# EAGLE schematic front-panel (EAGLE 5.11)

## Sheet 1 of 7
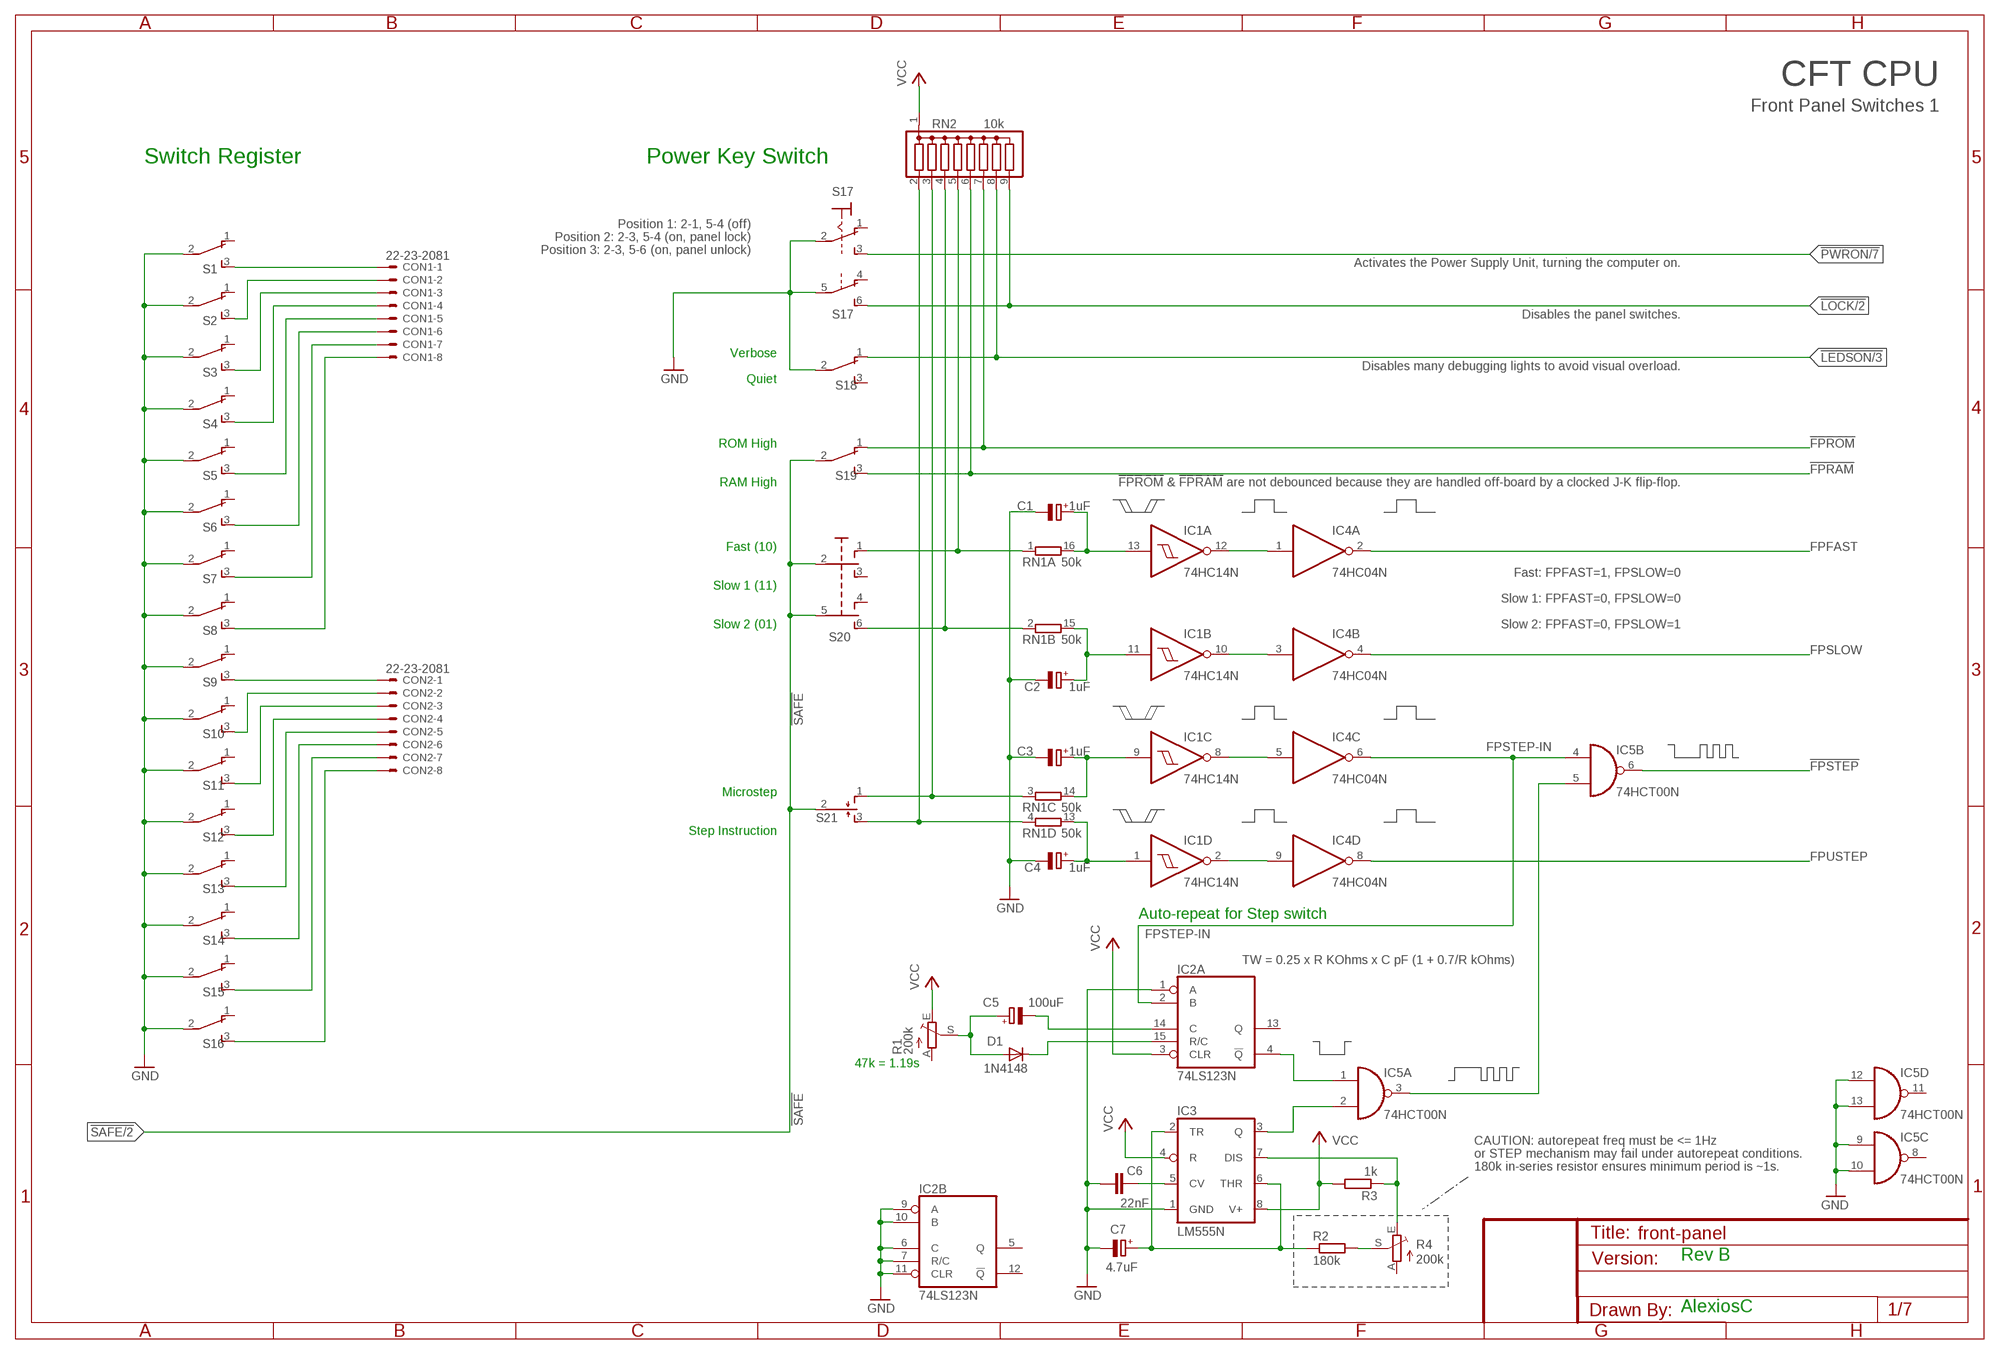
[diagram p0: schematic, sheet 1]

### Parts
C1  1uF  CPOL-EUE1.8-4  [E1,8-4]
C2  1uF  CPOL-EUE1.8-4  [E1,8-4]
C3  1uF  CPOL-EUE1.8-4  [E1,8-4]
C4  1uF  CPOL-EUE1.8-4  [E1,8-4]
C5  100uF  CPOL-EUE2,5-6E  [E2,5-6E]
C6  22nF  C-EU025-024X044  [C025-024X044]
C7  4.7uF  CPOL-EUE2,5-6E  [E2,5-6E]
CON1  22-23-2081  [22-23-2081]
CON2  22-23-2081  [22-23-2081]
D1  1N4148  1N4148DO35-7  [DO35-7]
IC1  74HC14N  [DIL14]
IC2  74LS123N  [DIL16]
IC3  LM555N  [DIL08]
IC4  74HC04N  [DIL14]
IC5  74HCT00N  [DIL14]
R1  200k  TRIM_EU-B90P  [SP19L]
R2  180k  R-EU_0207/10  [0207/10]
R3  1k  R-EU_0207/10  [0207/10]
R4  200k  TRIM_EU-B90P  [SP19L]
RN1  50k  8R-N  [DIL16]
RN2  10k  G08R  [SIL9]
S1  TL36PO  [TL3XPO]
S2  TL36PO  [TL3XPO]
S3  TL36PO  [TL3XPO]
S4  TL36PO  [TL3XPO]
S5  TL36PO  [TL3XPO]
S6  TL36PO  [TL3XPO]
S7  TL36PO  [TL3XPO]
S8  TL36PO  [TL3XPO]
S9  TL36PO  [TL3XPO]
S10  TL36PO  [TL3XPO]
S11  TL36PO  [TL3XPO]
S12  TL36PO  [TL3XPO]
S13  TL36PO  [TL3XPO]
S14  TL36PO  [TL3XPO]
S15  TL36PO  [TL3XPO]
S16  TL36PO  [TL3XPO]
S17  320-938  [320-938]
S18  TL36PO  [TL3XPO]
S19  TL36PO  [TL3XPO]
S20  TL49PO  [TL4XPO]
S21  TL37PO  [TL3XPO]

### Nets
!FPRAM: RN2.6 S19.3(S) ; also sheet 7
!FPROM: RN2.7 S19.1(O) ; also sheet 7
!FPSTEP: IC5.6(B:O) ; also sheet 7
!LEDSON: RN2.8 S18.1(O) ; also sheet 3,4,6
!LOCK: RN2.9 S17.6(B:S) ; also sheet 2
!PWRON: S17.3(1:S) ; also sheet 7
!SAFE: S20.2(P) S20.5(P1) S21.2(P) ; also sheet 2
FPFAST: IC4.2(A:O) ; also sheet 7
FPSLOW: IC4.4(B:O) ; also sheet 7
FPSTEP-IN: IC2.2(A:B) IC4.6(C:O) IC5.4(B:I0)
FPUSTEP: IC4.8(D:O) ; also sheet 7
GND: C1.- C2.- C3.- C4.- C6.2 C7.- IC2.1(A:A) IC2.6(B:C) IC2.7(B:R/C) IC2.9(B:A) IC2.10(B:B) IC2.11(B:CLR) IC3.1(GND) IC5.9(C:I0) IC5.10(C:I1) IC5.12(D:I0) IC5.13(D:I1) S1.2(P) S2.2(P) S3.2(P) S4.2(P) S5.2(P) S6.2(P) S7.2(P) S8.2(P) S9.2(P) S10.2(P) S11.2(P) S12.2(P) S13.2(P) S14.2(P) S15.2(P) S16.2(P) S17.2(1:P) S17.5(B:P) S18.2(P) ; also sheet 2,3,4,5,6,7
N$1: CON1.2 S2.3(S)
N$2: CON1.3 S3.3(S)
N$3: CON1.1 S1.3(S)
N$4: CON1.4 S4.3(S)
N$5: CON1.5 S5.3(S)
N$6: CON1.6 S6.3(S)
N$7: CON1.7 S7.3(S)
N$8: CON1.8 S8.3(S)
N$9: CON2.1 S9.3(S)
N$10: CON2.2 S10.3(S)
N$11: CON2.3 S11.3(S)
N$12: CON2.4 S12.3(S)
N$13: CON2.5 S13.3(S)
N$14: CON2.6 S14.3(S)
N$15: CON2.7 S15.3(S)
N$16: CON2.8 S16.3(S)
N$45: C3.+ IC1.9(C:I) RN1.14
N$48: C4.+ IC1.1(D:I) RN1.13
N$49: RN1.3 RN2.3 S21.1(O)
N$50: RN1.4 RN2.2 S21.3(S)
N$53: C1.+ IC1.13(A:I) RN1.16
N$54: RN1.1 RN2.5 S20.1(O)
N$55: RN1.2 RN2.4 S20.6(S1)
N$56: IC1.12(A:O) IC4.1(A:I)
N$57: C2.+ IC1.11(B:I) RN1.15
N$58: IC1.10(B:O) IC4.3(B:I)
N$78: IC1.2(D:O) IC4.9(D:I)
N$282: IC1.8(C:O) IC4.5(C:I)
N$293: R2.2 R4.S
N$323: C5.+ D1.A R1.S
N$324: IC3.3(Q) IC5.2(A:I1)
N$325: IC2.4(A:!Q) IC5.1(A:I0)
N$326: IC5.3(A:O) IC5.5(B:I1)
N$327: C6.1 IC3.5(CV)
N$328: IC3.7(DIS) R3.1 R4.E
N$329: D1.C IC2.15(A:R/C)
N$330: C5.- IC2.14(A:C)
N$331: C7.+ IC3.2(TR) IC3.6(THR) R2.1
VCC: IC2.3(A:CLR) IC3.4(R) IC3.8(V+) R1.E R3.2 RN2.1 ; also sheet 2,3,4,5,6,7
Unconnected: IC2.5(B:Q) IC2.12(B:!Q) IC2.13(A:Q) IC5.8(C:O) IC5.11(D:O) R1.A R4.A S1.1(O) S2.1(O) S3.1(O) S4.1(O) S5.1(O) S6.1(O) S7.1(O) S8.1(O) S9.1(O) S10.1(O) S11.1(O) S12.1(O) S13.1(O) S14.1(O) S15.1(O) S16.1(O) S17.1(1:O) S17.4(B:O) S18.3(S) S19.2(P) S20.3(S) S20.4(O1)

### Notes on the sheet
- CFT CPU
- Front Panel Switches 1
- Switch Register | Power Key Switch
- Position 1: 2-1, 5-4 (off)
- Position 2: 2-3, 5-4 (on, panel lock)
- Position 3: 2-3, 5-6 (on, panel unlock)
- Activates the Power Supply Unit, turning the computer on.
- Disables the panel switches.
- Verbose
- Disables many debugging lights to avoid visual overload.
- Quiet
- ROM High
- RAM High | !FPROM! & !FPRAM! are not debounced because they are handled off-board by a clocked J-K flip-flop.
- Fast (10)
- Fast: FPFAST=1, FPSLOW=0
- Slow 1 (11)
- Slow 1: FPFAST=0, FPSLOW=0
- Slow 2 (01) | Slow 2: FPFAST=0, FPSLOW=1
- Microstep
- Step Instruction
- Auto-repeat for Step switch
- TW = 0.25 x R KOhms x C pF (1 + 0.7/R kOhms)
- 47k = 1.19s
- CAUTION: autorepeat freq must be <= 1Hz
- or STEP mechanism may fail under autorepeat conditions.
- 180k in-series resistor ensures minimum period is ~1s.
- Rev B
- AlexiosC

## Sheet 2 of 7
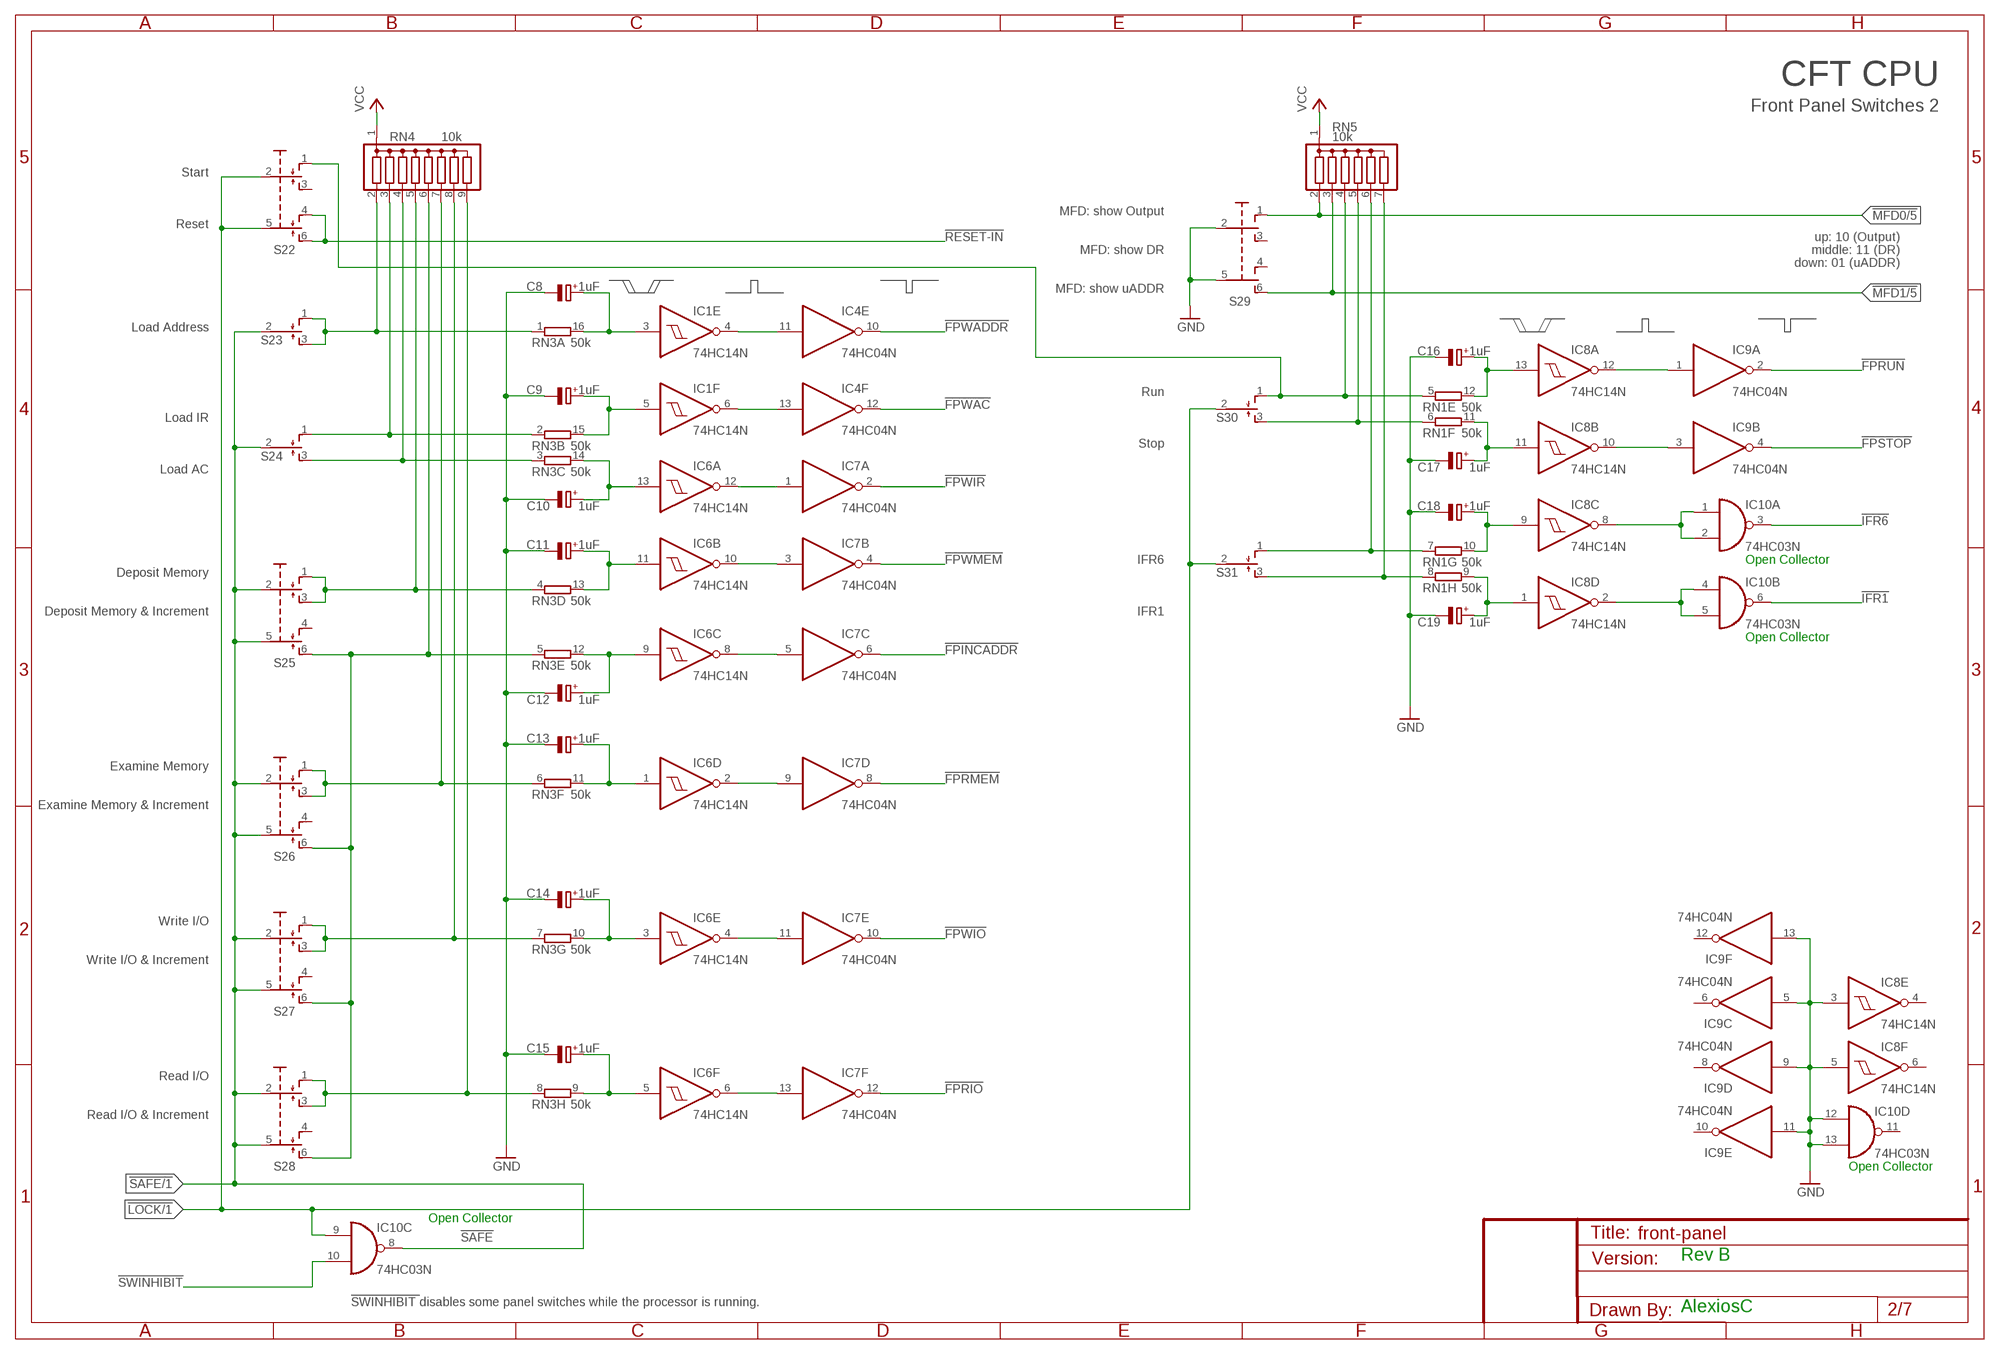
[diagram p1: schematic, sheet 2]

### Parts
C8  1uF  CPOL-EUE1.8-4  [E1,8-4]
C9  1uF  CPOL-EUE1.8-4  [E1,8-4]
C10  1uF  CPOL-EUE1.8-4  [E1,8-4]
C11  1uF  CPOL-EUE1.8-4  [E1,8-4]
C12  1uF  CPOL-EUE1.8-4  [E1,8-4]
C13  1uF  CPOL-EUE1.8-4  [E1,8-4]
C14  1uF  CPOL-EUE1.8-4  [E1,8-4]
C15  1uF  CPOL-EUE1.8-4  [E1,8-4]
C16  1uF  CPOL-EUE1.8-4  [E1,8-4]
C17  1uF  CPOL-EUE1.8-4  [E1,8-4]
C18  1uF  CPOL-EUE1.8-4  [E1,8-4]
C19  1uF  CPOL-EUE1.8-4  [E1,8-4]
IC6  74HC14N  [DIL14]
IC7  74HC04N  [DIL14]
IC8  74HC14N  [DIL14]
IC9  74HC04N  [DIL14]
IC10  74HC03N  [DIL14]
RN3  50k  8R-N  [DIL16]
RN4  10k  G08R  [SIL9]
RN5  10k  G06R  [SIL7]
S22  TL47PO  [TL4XPO]
S23  TL37PO  [TL3XPO]
S24  TL37PO  [TL3XPO]
S25  TL47PO  [TL4XPO]
S26  TL47PO  [TL4XPO]
S27  TL47PO  [TL4XPO]
S28  TL47PO  [TL4XPO]
S29  TL49PO  [TL4XPO]
S30  TL37PO  [TL3XPO]
S31  TL37PO  [TL3XPO]

### Nets
!FPINCADDR: IC7.6(C:O) ; also sheet 7
!FPRIO: IC7.12(F:O) ; also sheet 7
!FPRMEM: IC7.8(D:O) ; also sheet 7
!FPRUN: IC9.2(A:O) ; also sheet 7
!FPSTOP: IC9.4(B:O) ; also sheet 7
!FPWAC: IC4.12(F:O) ; also sheet 7
!FPWADDR: IC4.10(E:O) ; also sheet 7
!FPWIO: IC7.10(E:O) ; also sheet 7
!FPWIR: IC7.2(A:O) ; also sheet 7
!FPWMEM: IC7.4(B:O) ; also sheet 7
!IFR1: IC10.6(B:O) ; also sheet 6,7
!IFR6: IC10.3(A:O) ; also sheet 6,7
!LOCK: IC10.9(C:I0) S22.2(P) S22.5(P1) S30.2(P) S31.2(P) ; also sheet 1
!MFD0: RN5.2 S29.1(O) ; also sheet 5
!MFD1: RN5.3 S29.6(S1) ; also sheet 5
!RESET-IN: S22.4(O1) S22.6(S1) ; also sheet 7
!SAFE: IC10.8(C:O) S23.2(P) S24.2(P) S25.2(P) S25.5(P1) S26.2(P) S26.5(P1) S27.2(P) S27.5(P1) S28.2(P) S28.5(P1) ; also sheet 1
!SWINHIBIT: IC10.10(C:I1) ; also sheet 7
GND: C8.- C9.- C10.- C11.- C12.- C13.- C14.- C15.- C16.- C17.- C18.- C19.- IC8.3(E:I) IC8.5(F:I) IC9.5(C:I) IC9.9(D:I) IC9.11(E:I) IC9.13(F:I) IC10.12(D:I0) IC10.13(D:I1) S29.2(P) S29.5(P1) ; also sheet 1,3,4,5,6,7
N$17: C9.+ IC1.5(F:I) RN3.15
N$18: RN3.1 RN4.2 S23.1(O) S23.3(S)
N$19: C8.+ IC1.3(E:I) RN3.16
N$20: C10.+ IC6.13(A:I) RN3.14
N$21: IC1.4(E:O) IC4.11(E:I)
N$22: IC1.6(F:O) IC4.13(F:I)
N$23: IC6.12(A:O) IC7.1(A:I)
N$25: RN3.2 RN4.3 S24.1(O)
N$26: C14.+ IC6.3(E:I) RN3.10
N$27: IC6.10(B:O) IC7.3(B:I)
N$28: IC6.8(C:O) IC7.5(C:I)
N$29: C13.+ IC6.1(D:I) RN3.11
N$30: IC6.2(D:O) IC7.9(D:I)
N$31: IC6.4(E:O) IC7.11(E:I)
N$33: C15.+ IC6.5(F:I) RN3.9
N$35: IC6.6(F:O) IC7.13(F:I)
N$36: C11.+ IC6.11(B:I) RN3.13
N$37: RN3.3 RN4.4 S24.3(S)
N$38: RN3.4 RN4.5 S25.1(O) S25.3(S)
N$39: RN3.5 RN4.6 S25.6(S1) S26.6(S1) S27.6(S1) S28.6(S1)
N$40: RN3.6 RN4.7 S26.1(O) S26.3(S)
N$41: RN3.7 RN4.8 S27.1(O) S27.3(S)
N$42: RN3.8 RN4.9 S28.1(O) S28.3(S)
N$43: C16.+ IC8.13(A:I) RN1.12
N$44: C17.+ IC8.11(B:I) RN1.11
N$46: RN1.5 RN5.4 S22.1(O) S30.1(O)
N$47: RN1.6 RN5.5 S30.3(S)
N$51: C18.+ IC8.9(C:I) RN1.10
N$62: C19.+ IC8.1(D:I) RN1.9
N$77: RN1.7 RN5.6 S31.1(O)
N$79: RN1.8 RN5.7 S31.3(S)
N$80: IC8.8(C:O) IC10.1(A:I0) IC10.2(A:I1)
N$81: IC8.2(D:O) IC10.4(B:I0) IC10.5(B:I1)
N$295: IC8.12(A:O) IC9.1(A:I)
N$296: IC8.10(B:O) IC9.3(B:I)
N$297: C12.+ IC6.9(C:I) RN3.12
VCC: RN4.1 RN5.1 ; also sheet 1,3,4,5,6,7
Unconnected: IC8.4(E:O) IC8.6(F:O) IC9.6(C:O) IC9.8(D:O) IC9.10(E:O) IC9.12(F:O) IC10.11(D:O) S22.3(S) S25.4(O1) S26.4(O1) S27.4(O1) S28.4(O1) S29.3(S) S29.4(O1)

### Notes on the sheet
- CFT CPU
- Front Panel Switches 2
- Start
- MFD: show Output
- Reset
- up: 10 (Output)
- MFD: show DR | middle: 11 (DR)
- down: 01 (uADDR)
- MFD: show uADDR
- Load Address
- Run
- Load IR
- Stop
- Load AC
- IFR6 | Open Collector
- Deposit Memory
- Deposit Memory & Increment | IFR1
- Open Collector
- Examine Memory
- Examine Memory & Increment
- Write I/O
- Write I/O & Increment
- Read I/O
- Read I/O & Increment
- Open Collector
- Open Collector
- Rev B
- !SWINHIBIT !disables some panel switches while the processor is running.
- AlexiosC

## Sheet 3 of 7
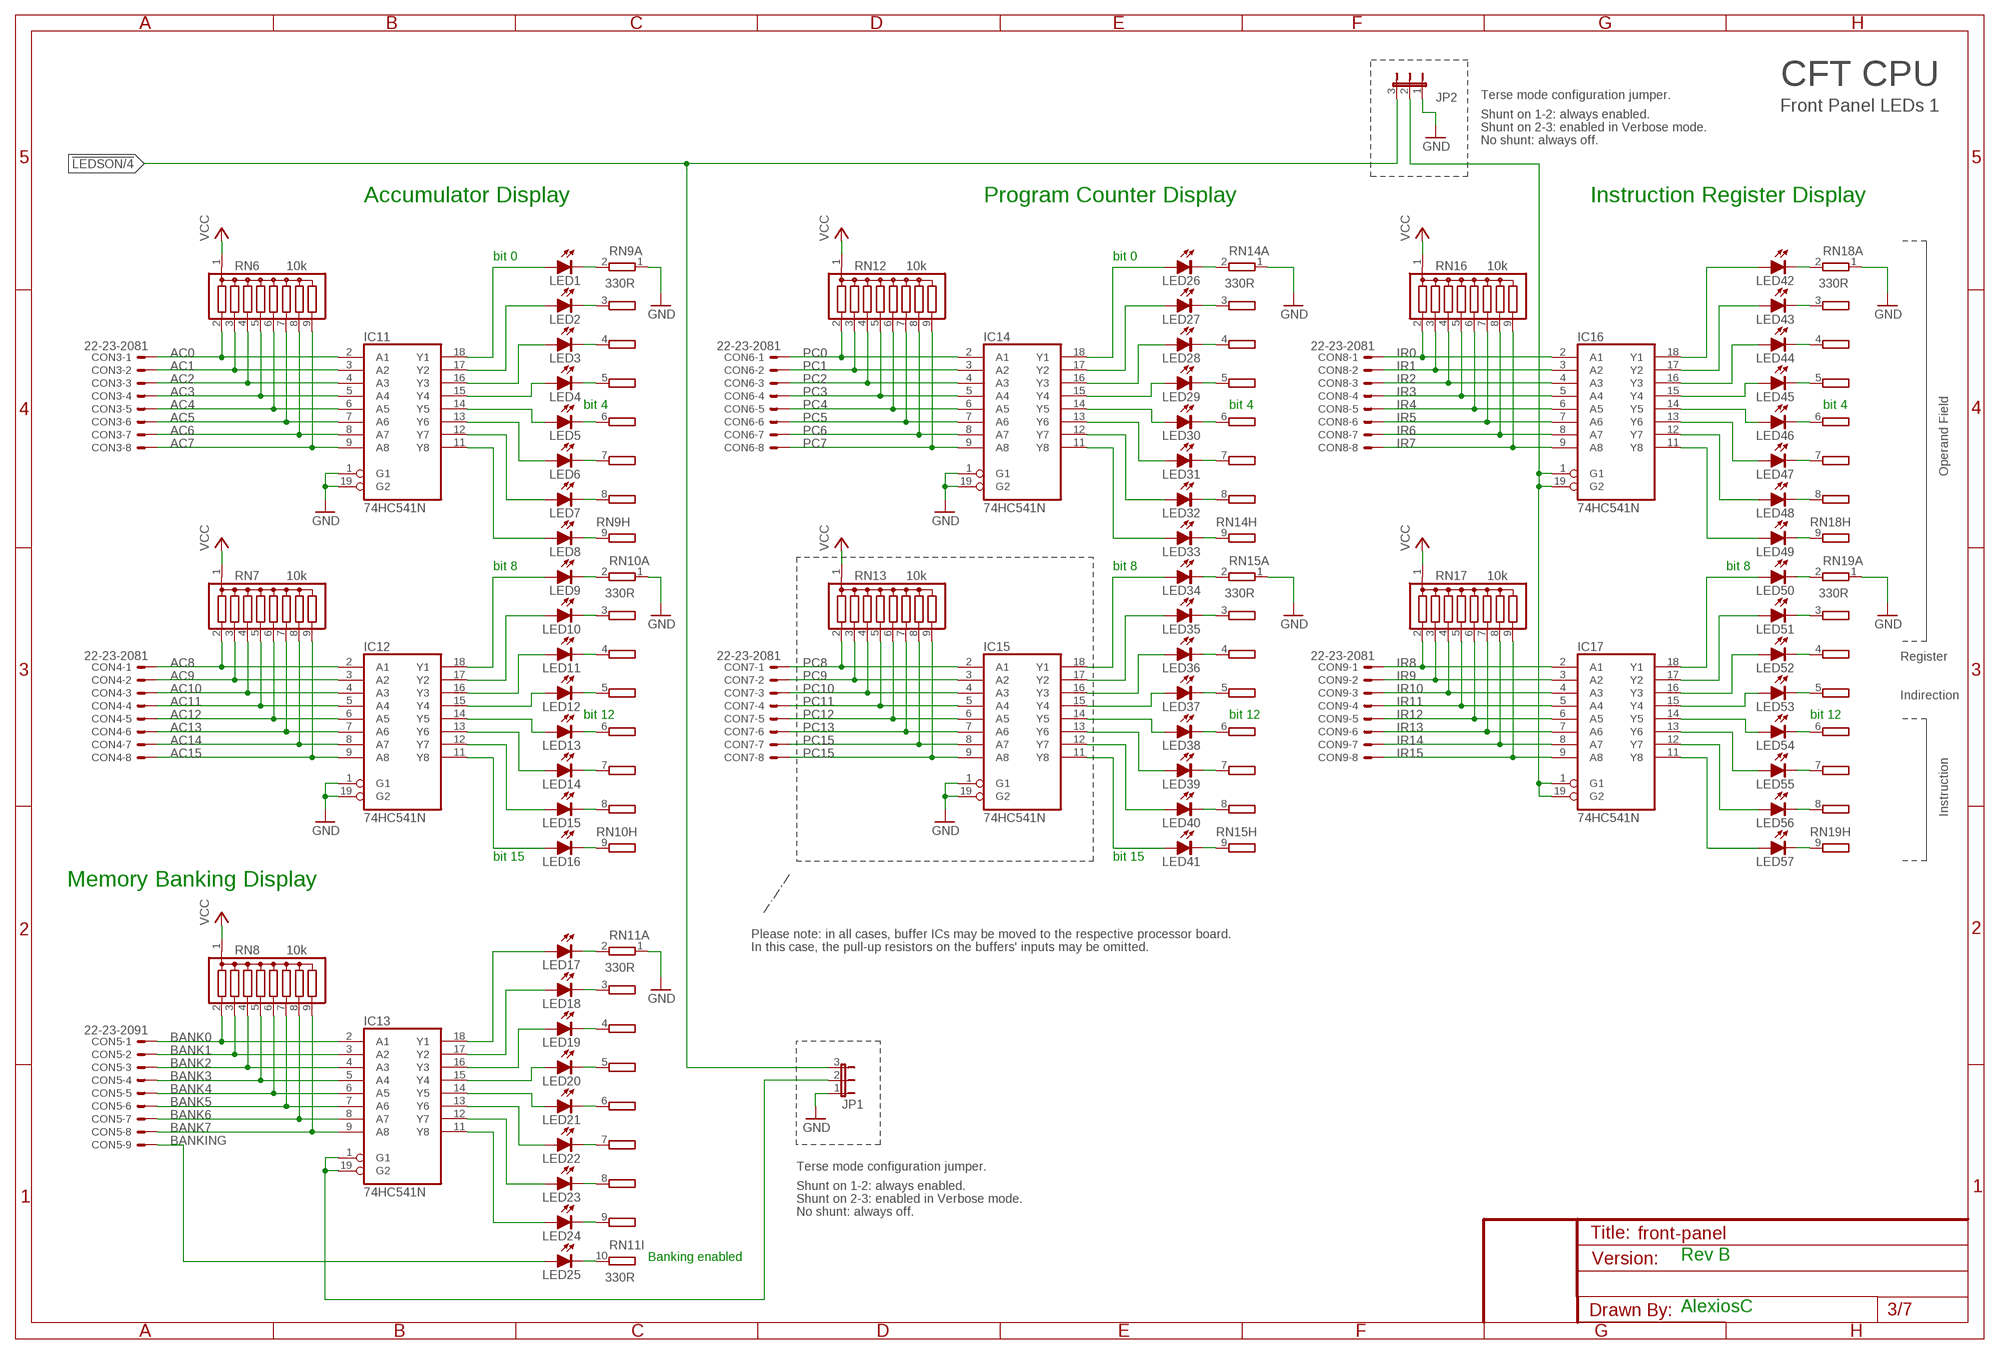
[diagram p2: schematic, sheet 3]

### Parts
CON3  22-23-2081  [22-23-2081]
CON4  22-23-2081  [22-23-2081]
CON5  22-23-2091  [22-23-2091]
CON6  22-23-2081  [22-23-2081]
CON7  22-23-2081  [22-23-2081]
CON8  22-23-2081  [22-23-2081]
CON9  22-23-2081  [22-23-2081]
IC11  74HC541N  [DIL20]
IC12  74HC541N  [DIL20]
IC13  74HC541N  [DIL20]
IC14  74HC541N  [DIL20]
IC15  74HC541N  [DIL20]
IC16  74HC541N  [DIL20]
IC17  74HC541N  [DIL20]
JP1  JP2E  [JP2]
JP2  JP2E  [JP2]
LED1  LED-5MM-RED  [LED5MM]
LED2  LED-5MM-RED  [LED5MM]
LED3  LED-5MM-RED  [LED5MM]
LED4  LED-5MM-RED  [LED5MM]
LED5  LED-5MM-RED  [LED5MM]
LED6  LED-5MM-RED  [LED5MM]
LED7  LED-5MM-RED  [LED5MM]
LED8  LED-5MM-RED  [LED5MM]
LED9  LED-5MM-RED  [LED5MM]
LED10  LED-5MM-RED  [LED5MM]
LED11  LED-5MM-RED  [LED5MM]
LED12  LED-5MM-RED  [LED5MM]
LED13  LED-5MM-RED  [LED5MM]
LED14  LED-5MM-RED  [LED5MM]
LED15  LED-5MM-RED  [LED5MM]
LED16  LED-5MM-RED  [LED5MM]
LED17  LED-5MM-AMBER  [LED5MM]
LED18  LED-5MM-AMBER  [LED5MM]
LED19  LED-5MM-AMBER  [LED5MM]
LED20  LED-5MM-AMBER  [LED5MM]
LED21  LED-5MM-AMBER  [LED5MM]
LED22  LED-5MM-AMBER  [LED5MM]
LED23  LED-5MM-AMBER  [LED5MM]
LED24  LED-5MM-AMBER  [LED5MM]
LED25  LED-5MM-GREEN  [LED5MM]
LED26  LED-5MM-RED  [LED5MM]
LED27  LED-5MM-RED  [LED5MM]
LED28  LED-5MM-RED  [LED5MM]
LED29  LED-5MM-RED  [LED5MM]
LED30  LED-5MM-RED  [LED5MM]
LED31  LED-5MM-RED  [LED5MM]
LED32  LED-5MM-RED  [LED5MM]
LED33  LED-5MM-RED  [LED5MM]
LED34  LED-5MM-RED  [LED5MM]
LED35  LED-5MM-RED  [LED5MM]
LED36  LED-5MM-RED  [LED5MM]
LED37  LED-5MM-RED  [LED5MM]
LED38  LED-5MM-RED  [LED5MM]
LED39  LED-5MM-RED  [LED5MM]
LED40  LED-5MM-RED  [LED5MM]
LED41  LED-5MM-RED  [LED5MM]
LED42  LED-5MM-RED  [LED5MM]
LED43  LED-5MM-RED  [LED5MM]
LED44  LED-5MM-RED  [LED5MM]
LED45  LED-5MM-RED  [LED5MM]
LED46  LED-5MM-RED  [LED5MM]
LED47  LED-5MM-RED  [LED5MM]
LED48  LED-5MM-RED  [LED5MM]
LED49  LED-5MM-RED  [LED5MM]
LED50  LED-5MM-RED  [LED5MM]
LED51  LED-5MM-RED  [LED5MM]
LED52  LED-5MM-AMBER  [LED5MM]
LED53  LED-5MM-RED  [LED5MM]
LED54  LED-5MM-AMBER  [LED5MM]
LED55  LED-5MM-AMBER  [LED5MM]
LED56  LED-5MM-AMBER  [LED5MM]
LED57  LED-5MM-AMBER  [LED5MM]
RN6  10k  G08R  [SIL9]
RN7  10k  G08R  [SIL9]
RN8  10k  G08R  [SIL9]
RN9  330R  GE08R  [SIL9]
RN10  330R  GE08R  [SIL9]
RN11  330R  GE09R  [SIL10]
RN12  10k  G08R  [SIL9]
RN13  10k  G08R  [SIL9]
RN14  330R  GE08R  [SIL9]
RN15  330R  GE08R  [SIL9]
RN16  10k  G08R  [SIL9]
RN17  10k  G08R  [SIL9]
RN18  330R  GE08R  [SIL9]
RN19  330R  GE08R  [SIL9]

### Nets
!LEDSON: JP1.3 JP2.3 ; also sheet 1,4,6
AC0: CON3.1 IC11.2(A1) RN6.2
AC1: CON3.2 IC11.3(A2) RN6.3
AC2: CON3.3 IC11.4(A3) RN6.4
AC3: CON3.4 IC11.5(A4) RN6.5
AC4: CON3.5 IC11.6(A5) RN6.6
AC5: CON3.6 IC11.7(A6) RN6.7
AC6: CON3.7 IC11.8(A7) RN6.8
AC7: CON3.8 IC11.9(A8) RN6.9
AC8: CON4.1 IC12.2(A1) RN7.2
AC9: CON4.2 IC12.3(A2) RN7.3
AC10: CON4.3 IC12.4(A3) RN7.4
AC11: CON4.4 IC12.5(A4) RN7.5
AC12: CON4.5 IC12.6(A5) RN7.6
AC13: CON4.6 IC12.7(A6) RN7.7
AC14: CON4.7 IC12.8(A7) RN7.8
AC15: CON4.8 IC12.9(A8) RN7.9
BANK0: CON5.1 IC13.2(A1) RN8.2
BANK1: CON5.2 IC13.3(A2) RN8.3
BANK2: CON5.3 IC13.4(A3) RN8.4
BANK3: CON5.4 IC13.5(A4) RN8.5
BANK4: CON5.5 IC13.6(A5) RN8.6
BANK5: CON5.6 IC13.7(A6) RN8.7
BANK6: CON5.7 IC13.8(A7) RN8.8
BANK7: CON5.8 IC13.9(A8) RN8.9
BANKING: CON5.9 LED25.A
GND: IC11.1(G1) IC11.19(G2) IC12.1(G1) IC12.19(G2) IC14.1(G1) IC14.19(G2) IC15.1(G1) IC15.19(G2) JP1.1 JP2.1 RN9.1 RN10.1 RN11.1 RN14.1 RN15.1 RN18.1 RN19.1 ; also sheet 1,2,4,5,6,7
IR0: CON8.1 IC16.2(A1) RN16.2
IR1: CON8.2 IC16.3(A2) RN16.3
IR2: CON8.3 IC16.4(A3) RN16.4
IR3: CON8.4 IC16.5(A4) RN16.5
IR4: CON8.5 IC16.6(A5) RN16.6
IR5: CON8.6 IC16.7(A6) RN16.7
IR6: CON8.7 IC16.8(A7) RN16.8
IR7: CON8.8 IC16.9(A8) RN16.9
IR8: CON9.1 IC17.2(A1) RN17.2
IR9: CON9.2 IC17.3(A2) RN17.3
IR10: CON9.3 IC17.4(A3) RN17.4
IR11: CON9.4 IC17.5(A4) RN17.5 ; also sheet 5
IR12: CON9.5 IC17.6(A5) RN17.6 ; also sheet 5
IR13: CON9.6 IC17.7(A6) RN17.7 ; also sheet 5
IR14: CON9.7 IC17.8(A7) RN17.8 ; also sheet 5
IR15: CON9.8 IC17.9(A8) RN17.9 ; also sheet 5
N$32: IC14.15(Y4) LED29.A
N$52: IC14.14(Y5) LED30.A
N$63: IC14.16(Y3) LED28.A
N$64: IC14.17(Y2) LED27.A
N$65: IC14.18(Y1) LED26.A
N$66: IC14.13(Y6) LED31.A
N$67: IC14.12(Y7) LED32.A
N$68: IC14.11(Y8) LED33.A
N$69: IC15.15(Y4) LED37.A
N$70: IC15.14(Y5) LED38.A
N$71: IC15.16(Y3) LED36.A
N$72: IC15.17(Y2) LED35.A
N$73: IC15.18(Y1) LED34.A
N$74: IC15.13(Y6) LED39.A
N$75: IC15.12(Y7) LED40.A
N$76: IC15.11(Y8) LED41.A
N$83: IC13.1(G1) IC13.19(G2) JP1.2
N$84: IC13.15(Y4) LED20.A
N$85: IC16.15(Y4) LED45.A
N$86: IC16.14(Y5) LED46.A
N$87: IC16.16(Y3) LED44.A
N$88: IC16.17(Y2) LED43.A
N$89: IC16.18(Y1) LED42.A
N$90: IC16.13(Y6) LED47.A
N$91: IC16.12(Y7) LED48.A
N$92: IC16.11(Y8) LED49.A
N$93: IC17.15(Y4) LED53.A
N$94: IC17.14(Y5) LED54.A
N$95: IC17.16(Y3) LED52.A
N$96: IC17.17(Y2) LED51.A
N$97: IC17.18(Y1) LED50.A
N$98: IC17.13(Y6) LED55.A
N$99: IC17.12(Y7) LED56.A
N$100: IC17.11(Y8) LED57.A
N$101: IC13.14(Y5) LED21.A
N$103: IC13.13(Y6) LED22.A
N$104: IC13.12(Y7) LED23.A
N$105: IC13.11(Y8) LED24.A
N$106: IC13.16(Y3) LED19.A
N$107: IC13.17(Y2) LED18.A
N$108: IC13.18(Y1) LED17.A
N$109: LED17.K(C) RN11.2
N$110: LED18.K(C) RN11.3
N$111: LED19.K(C) RN11.4
N$112: IC11.15(Y4) LED4.A
N$113: IC11.14(Y5) LED5.A
N$114: LED20.K(C) RN11.5
N$115: LED21.K(C) RN11.6
N$116: LED22.K(C) RN11.7
N$117: LED23.K(C) RN11.8
N$118: LED24.K(C) RN11.9
N$119: LED1.K(C) RN9.2
N$120: LED2.K(C) RN9.3
N$121: LED3.K(C) RN9.4
N$122: LED4.K(C) RN9.5
N$123: LED5.K(C) RN9.6
N$124: LED6.K(C) RN9.7
N$125: LED7.K(C) RN9.8
N$126: LED8.K(C) RN9.9
N$127: LED9.K(C) RN10.2
N$128: LED10.K(C) RN10.3
N$129: LED11.K(C) RN10.4
N$130: LED12.K(C) RN10.5
N$131: LED13.K(C) RN10.6
N$132: LED14.K(C) RN10.7
N$133: LED15.K(C) RN10.8
N$134: LED16.K(C) RN10.9
N$135: LED26.K(C) RN14.2
N$136: LED27.K(C) RN14.3
N$137: LED28.K(C) RN14.4
N$138: LED29.K(C) RN14.5
N$139: LED30.K(C) RN14.6
N$140: LED31.K(C) RN14.7
N$141: LED32.K(C) RN14.8
N$142: LED33.K(C) RN14.9
N$143: LED34.K(C) RN15.2
N$144: LED35.K(C) RN15.3
N$145: LED36.K(C) RN15.4
N$146: LED37.K(C) RN15.5
N$147: LED38.K(C) RN15.6
N$148: LED39.K(C) RN15.7
N$149: LED40.K(C) RN15.8
N$150: LED41.K(C) RN15.9
N$151: IC11.16(Y3) LED3.A
N$152: IC11.17(Y2) LED2.A
N$153: IC11.18(Y1) LED1.A
N$154: IC11.13(Y6) LED6.A
N$155: IC11.12(Y7) LED7.A
N$156: IC11.11(Y8) LED8.A
N$157: IC12.15(Y4) LED12.A
N$158: IC12.14(Y5) LED13.A
N$159: IC12.16(Y3) LED11.A
N$160: IC12.17(Y2) LED10.A
N$161: IC12.18(Y1) LED9.A
N$162: IC12.13(Y6) LED14.A
N$163: IC12.12(Y7) LED15.A
N$164: IC12.11(Y8) LED16.A
N$165: LED42.K(C) RN18.2
N$166: LED43.K(C) RN18.3
N$167: LED44.K(C) RN18.4
N$168: LED45.K(C) RN18.5
N$169: LED46.K(C) RN18.6
N$170: LED47.K(C) RN18.7
N$171: LED48.K(C) RN18.8
N$172: LED49.K(C) RN18.9
N$173: LED50.K(C) RN19.2
N$174: LED51.K(C) RN19.3
N$175: LED52.K(C) RN19.4
N$176: LED53.K(C) RN19.5
N$177: LED54.K(C) RN19.6
N$178: LED55.K(C) RN19.7
N$179: LED56.K(C) RN19.8
N$180: LED57.K(C) RN19.9
N$266: LED25.K(C) RN11.10
N$283: IC16.1(G1) IC16.19(G2) IC17.1(G1) IC17.19(G2) JP2.2
PC0: CON6.1 IC14.2(A1) RN12.2
PC1: CON6.2 IC14.3(A2) RN12.3
PC2: CON6.3 IC14.4(A3) RN12.4
PC3: CON6.4 IC14.5(A4) RN12.5
PC4: CON6.5 IC14.6(A5) RN12.6
PC5: CON6.6 IC14.7(A6) RN12.7
PC6: CON6.7 IC14.8(A7) RN12.8
PC7: CON6.8 IC14.9(A8) RN12.9
PC8: CON7.1 IC15.2(A1) RN13.2
PC9: CON7.2 IC15.3(A2) RN13.3
PC10: CON7.3 IC15.4(A3) RN13.4
PC11: CON7.4 IC15.5(A4) RN13.5
PC12: CON7.5 IC15.6(A5) RN13.6
PC13: CON7.6 IC15.7(A6) RN13.7
PC15: CON7.7 CON7.8 IC15.8(A7) IC15.9(A8) RN13.8 RN13.9
VCC: RN6.1 RN7.1 RN8.1 RN12.1 RN13.1 RN16.1 RN17.1 ; also sheet 1,2,4,5,6,7

### Notes on the sheet
- CFT CPU
- Terse mode configuration jumper.
- Front Panel LEDs 1
- Shunt on 1-2: always enabled.
- Shunt on 2-3: enabled in Verbose mode.
- No shunt: always off.
- Accumulator Display | Program Counter Display | Instruction Register Display
- bit 0 | bit 0
- Operand Field
- bit 4 | bit 4 | bit 4
- bit 8 | bit 8 | bit 8
- Register
- Indirection
- bit 12 | bit 12 | bit 12
- Instruction
- bit 15 | bit 15
- Memory Banking Display
- Please note: in all cases, buffer ICs may be moved to the respective processor board.
- In this case, the pull-up resistors on the buffers' inputs may be omitted.
- Terse mode configuration jumper.
- Shunt on 1-2: always enabled.
- Shunt on 2-3: enabled in Verbose mode.
- No shunt: always off.
- Banking enabled | Rev B
- AlexiosC

## Sheet 4 of 7
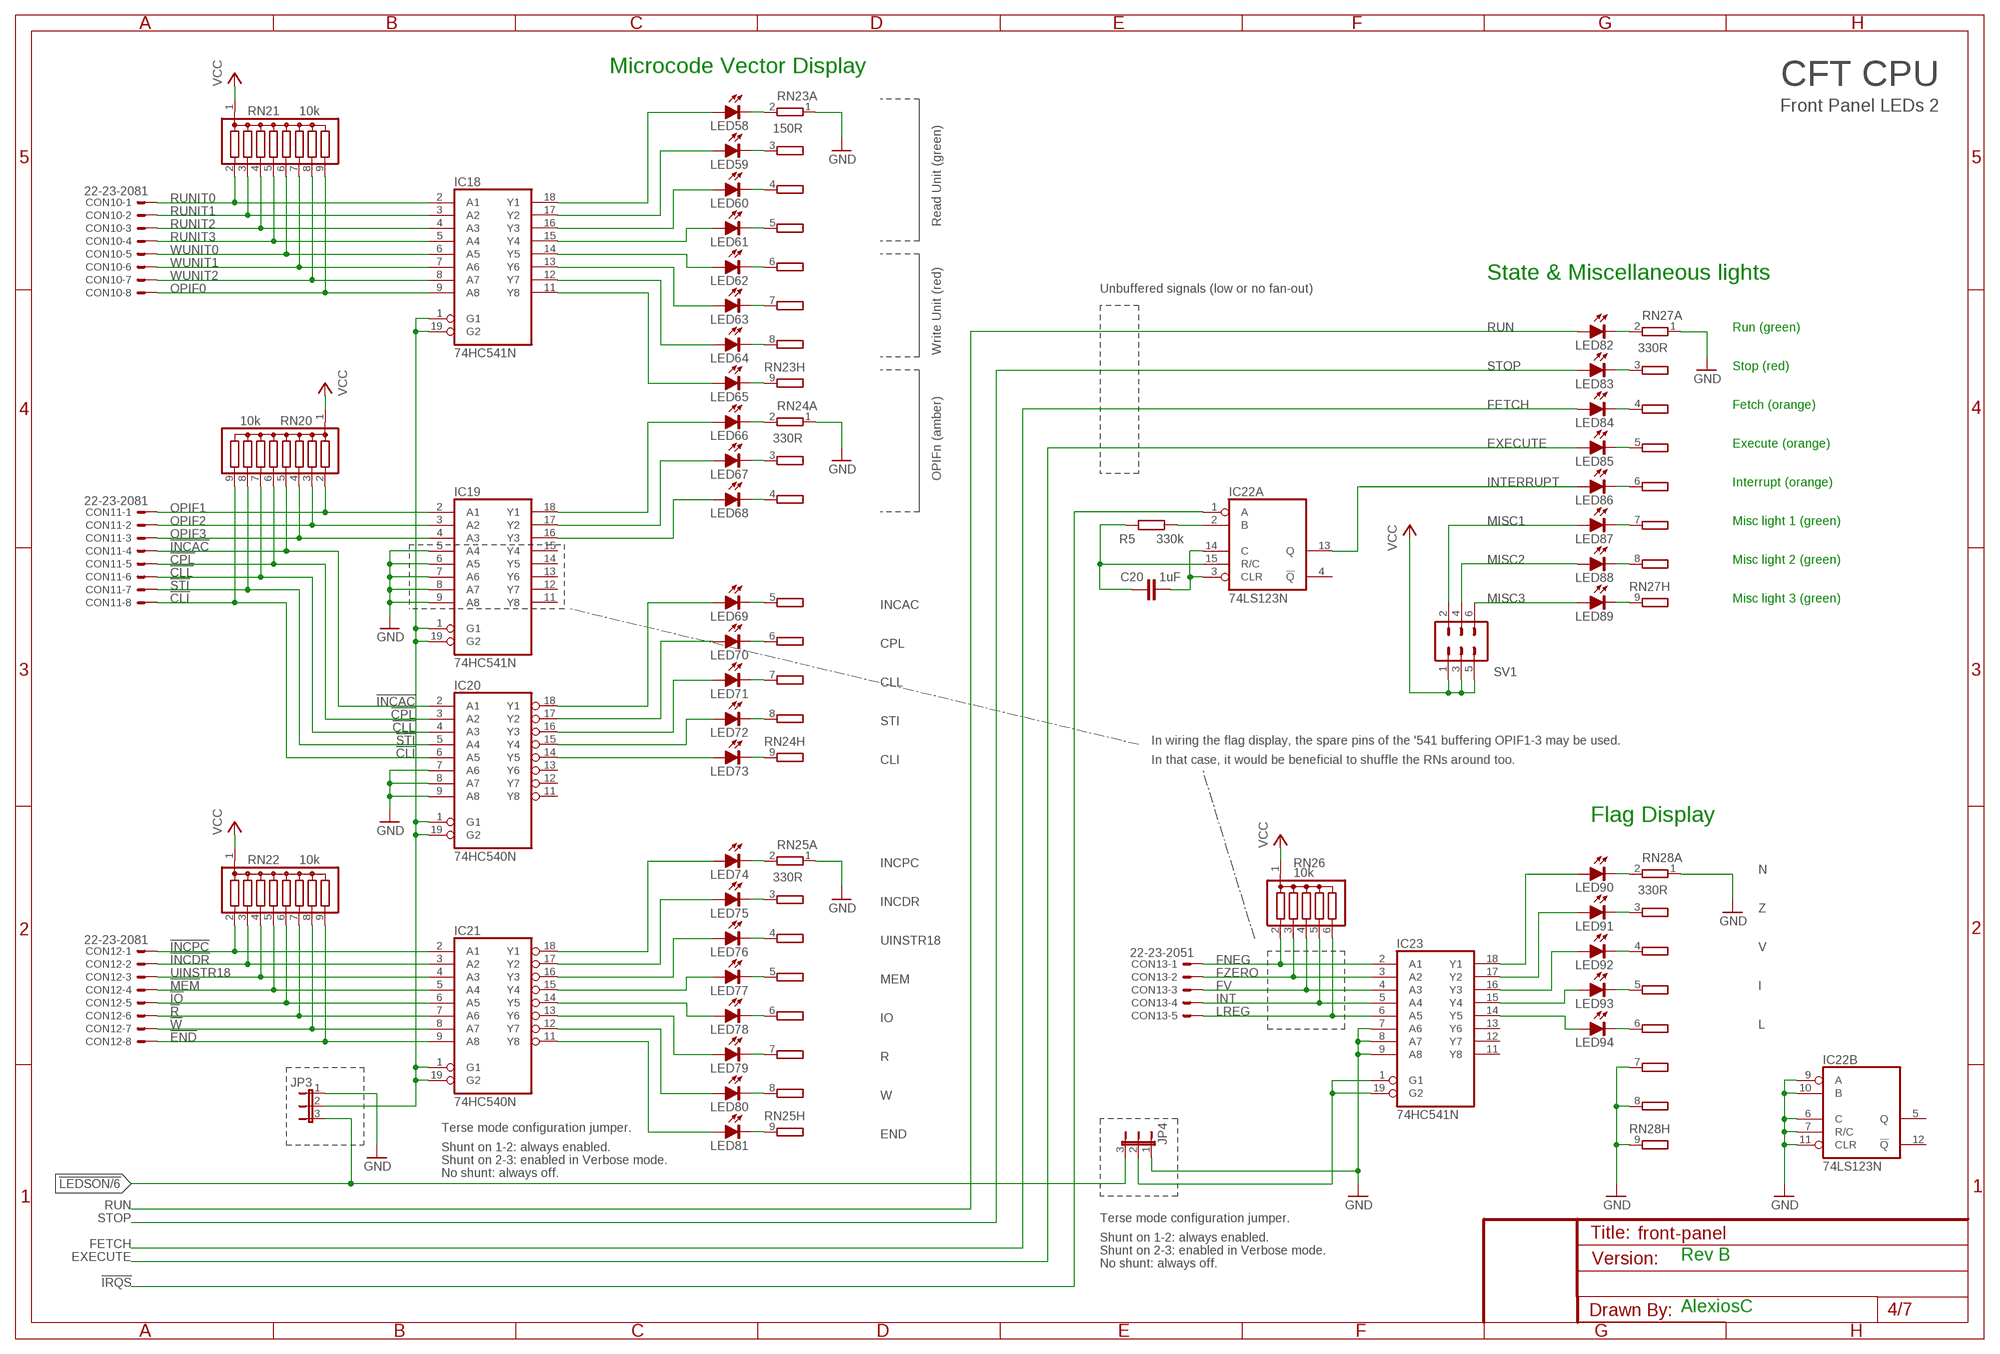
[diagram p3: schematic, sheet 4]

### Parts
C20  1uF  C-EU025-024X044  [C025-024X044]
CON10  22-23-2081  [22-23-2081]
CON11  22-23-2081  [22-23-2081]
CON12  22-23-2081  [22-23-2081]
CON13  22-23-2051  [22-23-2051]
IC18  74HC541N  [DIL20]
IC19  74HC541N  [DIL20]
IC20  74HC540N  [DIL20]
IC21  74HC540N  [DIL20]
IC22  74LS123N  [DIL16]
IC23  74HC541N  [DIL20]
JP3  JP2E  [JP2]
JP4  JP2E  [JP2]
LED58  LED-5MM-GREEN  [LED5MM]
LED59  LED-5MM-GREEN  [LED5MM]
LED60  LED-5MM-GREEN  [LED5MM]
LED61  LED-5MM-GREEN  [LED5MM]
LED62  LED-5MM-RED  [LED5MM]
LED63  LED-5MM-RED  [LED5MM]
LED64  LED-5MM-RED  [LED5MM]
LED65  LED-5MM-AMBER  [LED5MM]
LED66  LED-5MM-AMBER  [LED5MM]
LED67  LED-5MM-AMBER  [LED5MM]
LED68  LED-5MM-AMBER  [LED5MM]
LED69  LED-5MM-RED  [LED5MM]
LED70  LED-5MM-AMBER  [LED5MM]
LED71  LED-5MM-AMBER  [LED5MM]
LED72  LED-5MM-AMBER  [LED5MM]
LED73  LED-5MM-AMBER  [LED5MM]
LED74  LED-5MM-RED  [LED5MM]
LED75  LED-5MM-RED  [LED5MM]
LED76  LED-5MM-RED  [LED5MM]
LED77  LED-5MM-AMBER  [LED5MM]
LED78  LED-5MM-AMBER  [LED5MM]
LED79  LED-5MM-GREEN  [LED5MM]
LED80  LED-5MM-RED  [LED5MM]
LED81  LED-5MM-AMBER  [LED5MM]
LED82  LED-5MM-GREEN  [LED5MM]
LED83  LED-5MM-RED  [LED5MM]
LED84  LED-5MM-AMBER  [LED5MM]
LED85  LED-5MM-AMBER  [LED5MM]
LED86  LED-5MM-AMBER  [LED5MM]
LED87  LED-5MM-GREEN  [LED5MM]
LED88  LED-5MM-GREEN  [LED5MM]
LED89  LED-5MM-GREEN  [LED5MM]
LED90  LED-5MM-GREEN  [LED5MM]
LED91  LED-5MM-GREEN  [LED5MM]
LED92  LED-5MM-GREEN  [LED5MM]
LED93  LED-5MM-GREEN  [LED5MM]
LED94  LED-5MM-GREEN  [LED5MM]
R5  330k  R-EU_0204/5  [0204/5]
RN20  10k  G08R  [SIL9]
RN21  10k  G08R  [SIL9]
RN22  10k  G08R  [SIL9]
RN23  150R  GE08R  [SIL9]
RN24  330R  GE08R  [SIL9]
RN25  330R  GE08R  [SIL9]
RN26  10k  G05R  [SIL6]
RN27  330R  GE08R  [SIL9]
RN28  330R  GE08R  [SIL9]
SV1  3-pin-header  MA03-2  [MA03-2]

### Nets
!CLI: CON11.8 IC20.6(A5) RN20.9
!CLL: CON11.6 IC20.4(A3) RN20.7
!CPL: CON11.5 IC20.3(A2) RN20.6
!END: CON12.8 IC21.9(A8) RN22.9
!INCAC: CON11.4 IC20.2(A1) RN20.5
!INCDR: CON12.2 IC21.3(A2) RN22.3
!INCPC: CON12.1 IC21.2(A1) RN22.2
!IO: CON12.5 IC21.6(A5) RN22.6
!IRQS: IC22.1(A:A) ; also sheet 5,7
!LEDSON: JP3.3 JP4.3 ; also sheet 1,3,6
!MEM: CON12.4 IC21.5(A4) RN22.5
!R: CON12.6 IC21.7(A6) RN22.7
!STI: CON11.7 IC20.5(A4) RN20.8
!W: CON12.7 IC21.8(A7) RN22.8
EXECUTE: LED85.A ; also sheet 5
FETCH: LED84.A ; also sheet 5,7
FNEG: CON13.1 IC23.2(A1) RN26.2
FV: CON13.3 IC23.4(A3) RN26.4 ; also sheet 5
FZERO: CON13.2 IC23.3(A2) RN26.3
GND: IC19.5(A4) IC19.6(A5) IC19.7(A6) IC19.8(A7) IC19.9(A8) IC20.7(A6) IC20.8(A7) IC20.9(A8) IC22.6(B:C) IC22.7(B:R/C) IC22.9(B:A) IC22.10(B:B) IC22.11(B:CLR) IC23.7(A6) IC23.8(A7) IC23.9(A8) JP3.1 JP4.1 RN23.1 RN24.1 RN25.1 RN27.1 RN28.1 RN28.7 RN28.8 RN28.9 ; also sheet 1,2,3,5,6,7
INT: CON13.4 IC23.5(A4) RN26.5
INTERRUPT: IC22.13(A:Q) LED86.A
LREG: CON13.5 IC23.6(A5) RN26.6
MISC1: LED87.A SV1.2
MISC2: LED88.A SV1.4
MISC3: LED89.A SV1.6
N$24: IC23.1(G1) IC23.19(G2) JP4.2
N$59: C20.2 IC22.3(A:CLR) IC22.14(A:C)
N$60: IC22.2(A:B) R5.1
N$61: IC23.15(Y4) LED93.A
N$82: IC18.1(G1) IC18.19(G2) IC19.1(G1) IC19.19(G2) IC20.1(G1) IC20.19(G2) IC21.1(G1) IC21.19(G2) JP3.2
N$181: LED58.K(C) RN23.2
N$182: LED59.K(C) RN23.3
N$183: LED60.K(C) RN23.4
N$184: LED61.K(C) RN23.5
N$185: LED62.K(C) RN23.6
N$186: LED63.K(C) RN23.7
N$187: LED64.K(C) RN23.8
N$188: LED65.K(C) RN23.9
N$189: LED66.K(C) RN24.2
N$190: LED67.K(C) RN24.3
N$191: LED68.K(C) RN24.4
N$192: LED69.K(C) RN24.5
N$193: LED70.K(C) RN24.6
N$194: LED71.K(C) RN24.7
N$195: LED72.K(C) RN24.8
N$196: LED73.K(C) RN24.9
N$197: LED74.K(C) RN25.2
N$198: LED75.K(C) RN25.3
N$199: LED76.K(C) RN25.4
N$200: LED77.K(C) RN25.5
N$201: LED78.K(C) RN25.6
N$202: LED79.K(C) RN25.7
N$203: LED80.K(C) RN25.8
N$204: LED81.K(C) RN25.9
N$205: IC21.15(Y4) LED77.A
N$206: IC21.14(Y5) LED78.A
N$207: IC21.16(Y3) LED76.A
N$208: IC21.17(Y2) LED75.A
N$209: IC21.18(Y1) LED74.A
N$210: IC21.13(Y6) LED79.A
N$211: IC21.12(Y7) LED80.A
N$212: IC21.11(Y8) LED81.A
N$213: IC18.15(Y4) LED61.A
N$214: IC18.14(Y5) LED62.A
N$215: IC18.16(Y3) LED60.A
N$216: IC18.17(Y2) LED59.A
N$217: IC18.18(Y1) LED58.A
N$218: IC18.13(Y6) LED63.A
N$219: IC18.12(Y7) LED64.A
N$220: IC18.11(Y8) LED65.A
N$221: IC20.18(Y1) LED69.A
N$222: IC20.17(Y2) LED70.A
N$223: IC19.16(Y3) LED68.A
N$224: IC19.17(Y2) LED67.A
N$225: IC19.18(Y1) LED66.A
N$226: IC20.16(Y3) LED71.A
N$227: IC20.15(Y4) LED72.A
N$228: IC20.14(Y5) LED73.A
N$229: IC23.14(Y5) LED94.A
N$233: IC23.16(Y3) LED92.A
N$234: IC23.17(Y2) LED91.A
N$235: IC23.18(Y1) LED90.A
N$236: LED90.K(C) RN28.2
N$237: LED91.K(C) RN28.3
N$238: LED92.K(C) RN28.4
N$239: LED93.K(C) RN28.5
N$240: LED94.K(C) RN28.6
N$264: LED82.K(C) RN27.2
N$265: LED83.K(C) RN27.3
N$267: LED84.K(C) RN27.4
N$276: LED85.K(C) RN27.5
N$277: LED86.K(C) RN27.6
N$278: LED87.K(C) RN27.7
N$279: LED88.K(C) RN27.8
N$280: LED89.K(C) RN27.9
N$286: C20.1 IC22.15(A:R/C) R5.2
OPIF0: CON10.8 IC18.9(A8) RN21.9
OPIF1: CON11.1 IC19.2(A1) RN20.2
OPIF2: CON11.2 IC19.3(A2) RN20.3
OPIF3: CON11.3 IC19.4(A3) RN20.4
RUN: LED82.A ; also sheet 7
RUNIT0: CON10.1 IC18.2(A1) RN21.2
RUNIT1: CON10.2 IC18.3(A2) RN21.3
RUNIT2: CON10.3 IC18.4(A3) RN21.4
RUNIT3: CON10.4 IC18.5(A4) RN21.5
STOP: LED83.A ; also sheet 7
UINSTR18: CON12.3 IC21.4(A3) RN22.4
VCC: RN20.1 RN21.1 RN22.1 RN26.1 SV1.1 SV1.3 SV1.5 ; also sheet 1,2,3,5,6,7
WUNIT0: CON10.5 IC18.6(A5) RN21.6
WUNIT1: CON10.6 IC18.7(A6) RN21.7
WUNIT2: CON10.7 IC18.8(A7) RN21.8
Unconnected: IC19.11(Y8) IC19.12(Y7) IC19.13(Y6) IC19.14(Y5) IC19.15(Y4) IC20.11(Y8) IC20.12(Y7) IC20.13(Y6) IC22.4(A:!Q) IC22.5(B:Q) IC22.12(B:!Q) IC23.11(Y8) IC23.12(Y7) IC23.13(Y6)

### Notes on the sheet
- Microcode Vector Display
- CFT CPU
- Front Panel LEDs 2
- Read Unit (green)
- Write Unit (red)
- State & Miscellaneous lights
- Unbuffered signals (low or no fan-out)
- Run (green)
- Stop (red)
- OPIFn (amber)
- Fetch (orange)
- Execute (orange)
- Interrupt (orange)
- Misc light 1 (green)
- Misc light 2 (green)
- Misc light 3 (green)
- INCAC
- CPL
- CLL
- STI
- In wiring the flag display, the spare pins of the '541 buffering OPIF1-3 may be used.
- CLI | In that case, it would be beneficial to shuffle the RNs around too.
- Flag Display
- INCPC
- N
- INCDR
- Z
- UINSTR18
- V
- MEM
- I
- IO
- L
- R
- W
- Terse mode configuration jumper.
- END
- Shunt on 1-2: always enabled.
- Shunt on 2-3: enabled in Verbose mode.
- No shunt: always off.
- Terse mode configuration jumper.
- Shunt on 1-2: always enabled.
- Shunt on 2-3: enabled in Verbose mode.
- Rev B
- No shunt: always off.
- AlexiosC

## Sheet 5 of 7
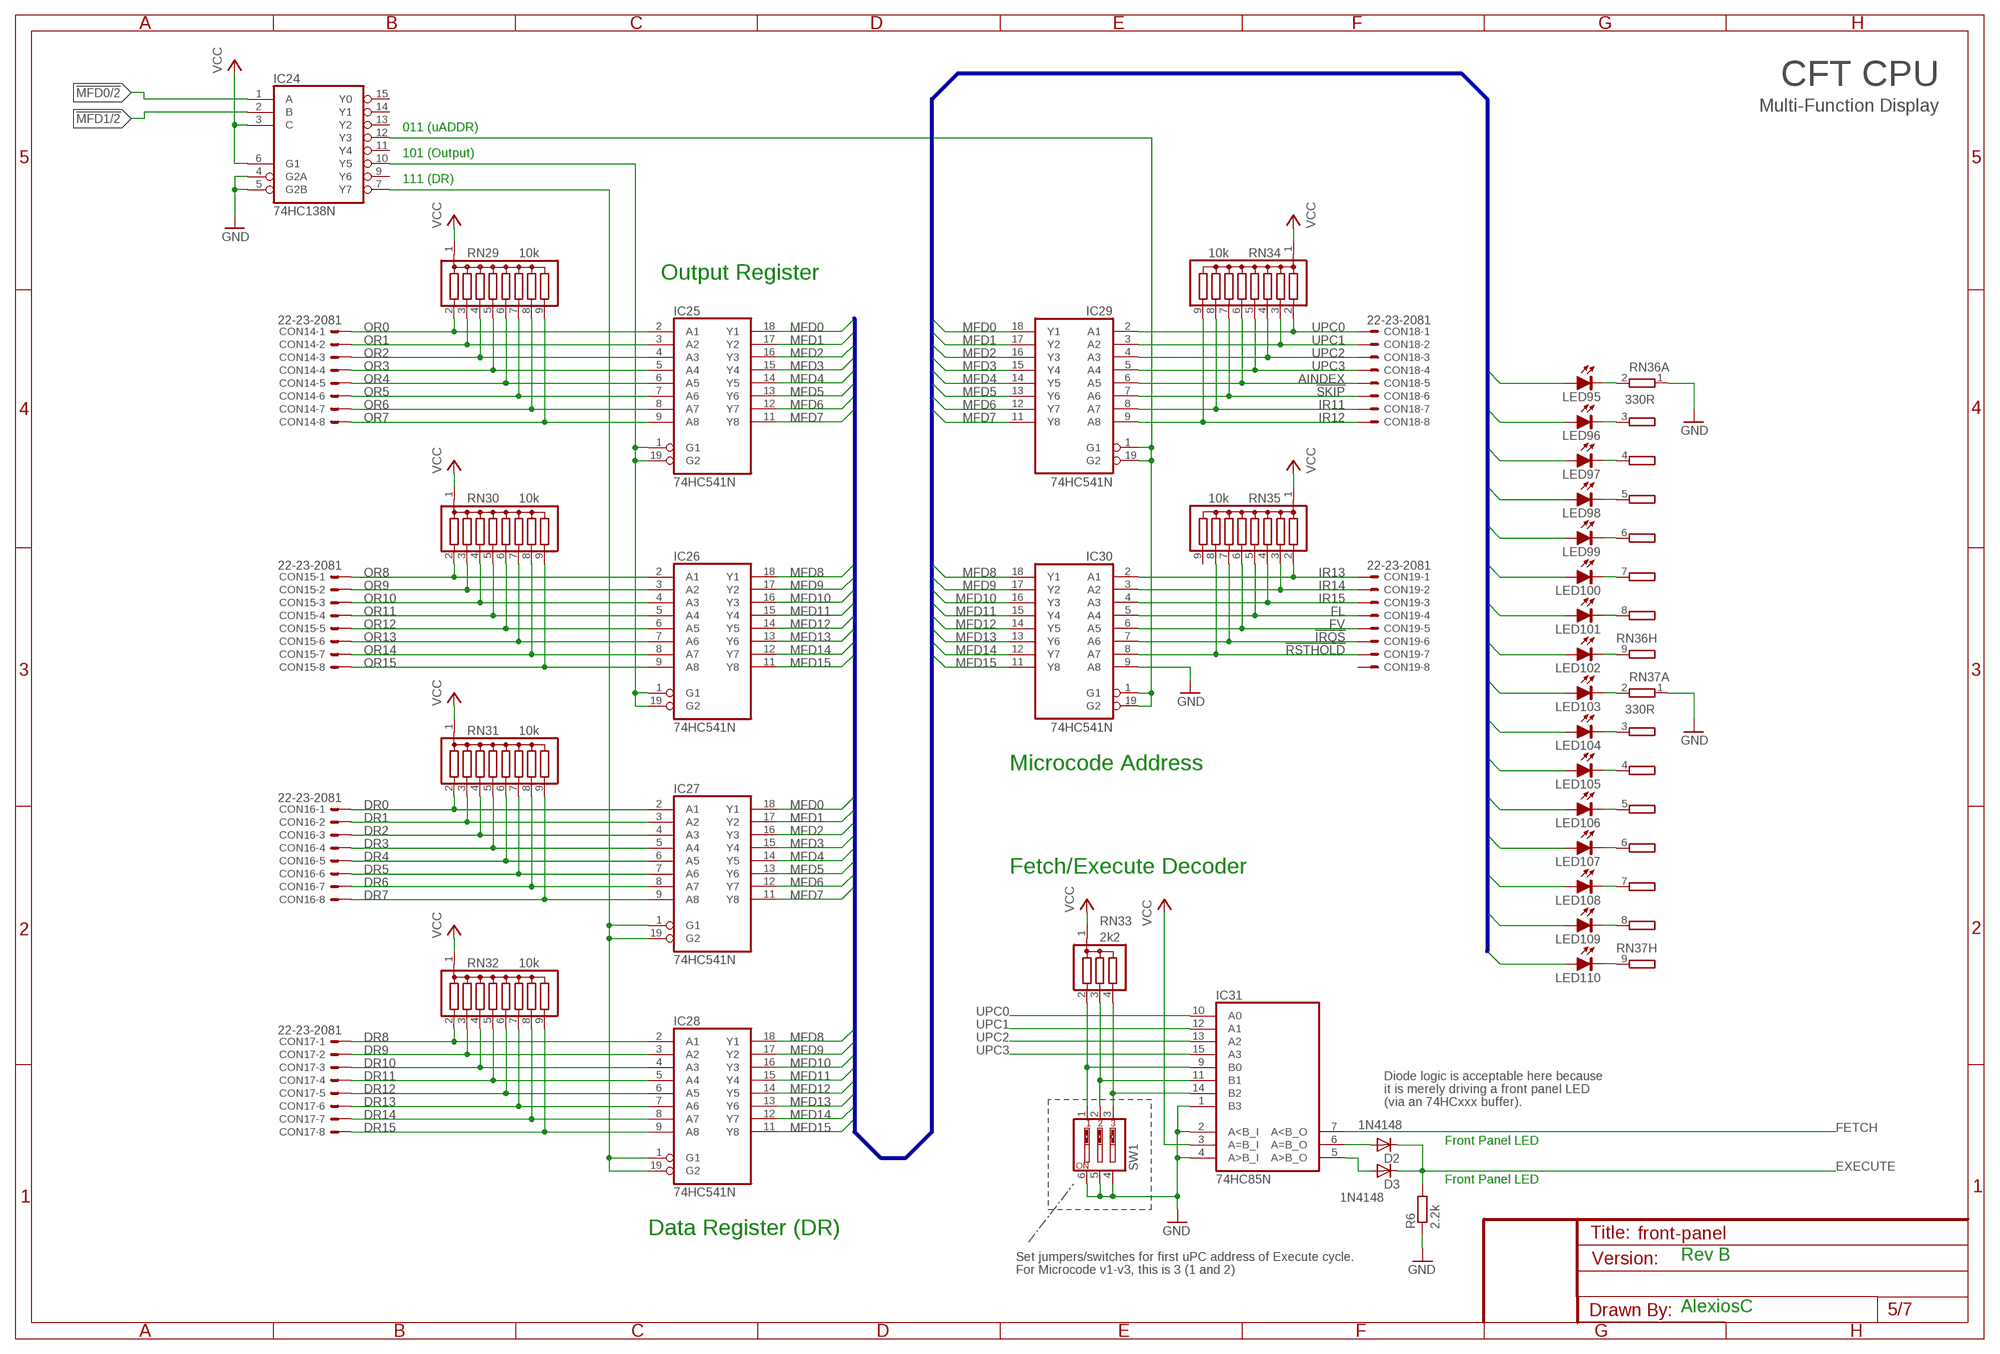
[diagram p4: schematic, sheet 5]

### Parts
CON14  22-23-2081  [22-23-2081]
CON15  22-23-2081  [22-23-2081]
CON16  22-23-2081  [22-23-2081]
CON17  22-23-2081  [22-23-2081]
CON18  22-23-2081  [22-23-2081]
CON19  22-23-2081  [22-23-2081]
D2  1N4148  1N4148DO35-7  [DO35-7]
D3  1N4148  1N4148DO35-7  [DO35-7]
IC24  74HC138N  [DIL16]
IC25  74HC541N  [DIL20]
IC26  74HC541N  [DIL20]
IC27  74HC541N  [DIL20]
IC28  74HC541N  [DIL20]
IC29  74HC541N  [DIL20]
IC30  74HC541N  [DIL20]
IC31  74HC85N  [DIL16]
LED95  LED-5MM-RED  [LED5MM]
LED96  LED-5MM-RED  [LED5MM]
LED97  LED-5MM-RED  [LED5MM]
LED98  LED-5MM-RED  [LED5MM]
LED99  LED-5MM-RED  [LED5MM]
LED100  LED-5MM-RED  [LED5MM]
LED101  LED-5MM-RED  [LED5MM]
LED102  LED-5MM-RED  [LED5MM]
LED103  LED-5MM-RED  [LED5MM]
LED104  LED-5MM-RED  [LED5MM]
LED105  LED-5MM-RED  [LED5MM]
LED106  LED-5MM-RED  [LED5MM]
LED107  LED-5MM-RED  [LED5MM]
LED108  LED-5MM-RED  [LED5MM]
LED109  LED-5MM-RED  [LED5MM]
LED110  LED-5MM-RED  [LED5MM]
R6  2.2k  R-EU_0204/7  [0204/7]
RN29  10k  G08R  [SIL9]
RN30  10k  G08R  [SIL9]
RN31  10k  G08R  [SIL9]
RN32  10k  G08R  [SIL9]
RN33  2k2  G03R  [SIL4]
RN34  10k  G08R  [SIL9]
RN35  10k  G08R  [SIL9]
RN36  330R  GE08R  [SIL9]
RN37  330R  GE08R  [SIL9]
SW1  SW_DIP-3  [EDG-03]

### Nets
!IRQS: CON19.6 IC30.7(A6) RN35.7 ; also sheet 4,7
!MFD0: IC24.1(A) ; also sheet 2
!MFD1: IC24.2(B) ; also sheet 2
!RSTHOLD: CON19.7 IC30.8(A7) RN35.8
!SKIP: CON18.6 IC29.7(A6) RN34.7
AINDEX: CON18.5 IC29.6(A5) RN34.6
DR0: CON16.1 IC27.2(A1) RN31.2
DR1: CON16.2 IC27.3(A2) RN31.3
DR2: CON16.3 IC27.4(A3) RN31.4
DR3: CON16.4 IC27.5(A4) RN31.5
DR4: CON16.5 IC27.6(A5) RN31.6
DR5: CON16.6 IC27.7(A6) RN31.7
DR6: CON16.7 IC27.8(A7) RN31.8
DR7: CON16.8 IC27.9(A8) RN31.9
DR8: CON17.1 IC28.2(A1) RN32.2
DR9: CON17.2 IC28.3(A2) RN32.3
DR10: CON17.3 IC28.4(A3) RN32.4
DR11: CON17.4 IC28.5(A4) RN32.5
DR12: CON17.5 IC28.6(A5) RN32.6
DR13: CON17.6 IC28.7(A6) RN32.7
DR14: CON17.7 IC28.8(A7) RN32.8
DR15: CON17.8 IC28.9(A8) RN32.9
EXECUTE: D2.C D3.C R6.2 ; also sheet 4
FETCH: IC31.7(A<B_O) ; also sheet 4,7
FL: CON19.4 IC30.5(A4) RN35.5
FV: CON19.5 IC30.6(A5) RN35.6 ; also sheet 4
GND: IC24.4(G2A) IC24.5(G2B) IC30.9(A8) IC31.1(B3) IC31.2(A<B_I) IC31.4(A>B_I) R6.1 RN36.1 RN37.1 SW1.4 SW1.5 SW1.6 ; also sheet 1,2,3,4,6,7
IR11: CON18.7 IC29.8(A7) RN34.8 ; also sheet 3
IR12: CON18.8 IC29.9(A8) RN34.9 ; also sheet 3
IR13: CON19.1 IC30.2(A1) RN35.2 ; also sheet 3
IR14: CON19.2 IC30.3(A2) RN35.3 ; also sheet 3
IR15: CON19.3 IC30.4(A3) RN35.4 ; also sheet 3
MFD0: IC25.18(Y1) IC27.18(Y1) IC29.18(Y1) LED95.A
MFD1: IC25.17(Y2) IC27.17(Y2) IC29.17(Y2) LED96.A
MFD2: IC25.16(Y3) IC27.16(Y3) IC29.16(Y3) LED97.A
MFD3: IC25.15(Y4) IC27.15(Y4) IC29.15(Y4) LED98.A
MFD4: IC25.14(Y5) IC27.14(Y5) IC29.14(Y5) LED99.A
MFD5: IC25.13(Y6) IC27.13(Y6) IC29.13(Y6) LED100.A
MFD6: IC25.12(Y7) IC27.12(Y7) IC29.12(Y7) LED101.A
MFD7: IC25.11(Y8) IC27.11(Y8) IC29.11(Y8) LED102.A
MFD8: IC26.18(Y1) IC28.18(Y1) IC30.18(Y1) LED103.A
MFD9: IC26.17(Y2) IC28.17(Y2) IC30.17(Y2) LED104.A
MFD10: IC26.16(Y3) IC28.16(Y3) IC30.16(Y3) LED105.A
MFD11: IC26.15(Y4) IC28.15(Y4) IC30.15(Y4) LED106.A
MFD12: IC26.14(Y5) IC28.14(Y5) IC30.14(Y5) LED107.A
MFD13: IC26.13(Y6) IC28.13(Y6) IC30.13(Y6) LED108.A
MFD14: IC26.12(Y7) IC28.12(Y7) IC30.12(Y7) LED109.A
MFD15: IC26.11(Y8) IC28.11(Y8) IC30.11(Y8) LED110.A
N$230: LED103.K(C) RN37.2
N$231: IC24.12(Y3) IC29.1(G1) IC29.19(G2) IC30.1(G1) IC30.19(G2)
N$232: LED104.K(C) RN37.3
N$241: IC24.7(Y7) IC27.1(G1) IC27.19(G2) IC28.1(G1) IC28.19(G2)
N$242: LED105.K(C) RN37.4
N$243: LED106.K(C) RN37.5
N$244: LED107.K(C) RN37.6
N$245: LED108.K(C) RN37.7
N$246: LED109.K(C) RN37.8
N$247: LED110.K(C) RN37.9
N$268: LED95.K(C) RN36.2
N$269: LED96.K(C) RN36.3
N$270: LED97.K(C) RN36.4
N$271: LED98.K(C) RN36.5
N$272: LED99.K(C) RN36.6
N$273: LED100.K(C) RN36.7
N$274: LED101.K(C) RN36.8
N$275: LED102.K(C) RN36.9
N$281: IC31.9(B0) RN33.2 SW1.1
N$284: IC31.11(B1) RN33.3 SW1.2
N$290: IC31.14(B2) RN33.4 SW1.3
N$291: D2.A IC31.6(A=B_O)
N$292: D3.A IC31.5(A>B_O)
N$313: IC24.10(Y5) IC25.1(G1) IC25.19(G2) IC26.1(G1) IC26.19(G2)
OR0: CON14.1 IC25.2(A1) RN29.2
OR1: CON14.2 IC25.3(A2) RN29.3
OR2: CON14.3 IC25.4(A3) RN29.4
OR3: CON14.4 IC25.5(A4) RN29.5
OR4: CON14.5 IC25.6(A5) RN29.6
OR5: CON14.6 IC25.7(A6) RN29.7
OR6: CON14.7 IC25.8(A7) RN29.8
OR7: CON14.8 IC25.9(A8) RN29.9
OR8: CON15.1 IC26.2(A1) RN30.2
OR9: CON15.2 IC26.3(A2) RN30.3
OR10: CON15.3 IC26.4(A3) RN30.4
OR11: CON15.4 IC26.5(A4) RN30.5
OR12: CON15.5 IC26.6(A5) RN30.6
OR13: CON15.6 IC26.7(A6) RN30.7
OR14: CON15.7 IC26.8(A7) RN30.8
OR15: CON15.8 IC26.9(A8) RN30.9
UPC0: CON18.1 IC29.2(A1) IC31.10(A0) RN34.2
UPC1: CON18.2 IC29.3(A2) IC31.12(A1) RN34.3
UPC2: CON18.3 IC29.4(A3) IC31.13(A2) RN34.4
UPC3: CON18.4 IC29.5(A4) IC31.15(A3) RN34.5
VCC: IC24.3(C) IC24.6(G1) IC31.3(A=B_I) RN29.1 RN30.1 RN31.1 RN32.1 RN33.1 RN34.1 RN35.1 ; also sheet 1,2,3,4,6,7
Unconnected: CON19.8 IC24.9(Y6) IC24.11(Y4) IC24.13(Y2) IC24.14(Y1) IC24.15(Y0) RN35.9

### Buses
MFD[0..15]

### Notes on the sheet
- CFT CPU
- Multi-Function Display
- 011 (uADDR)
- 101 (Output)
- 111 (DR)
- Output Register
- Microcode Address
- Fetch/Execute Decoder
- Diode logic is acceptable here because
- it is merely driving a front panel LED
- (via an 74HCxxx buffer).
- Front Panel LED
- Front Panel LED
- Data Register (DR)
- Set jumpers/switches for first uPC address of Execute cycle. | Rev B
- For Microcode v1-v3, this is 3 (1 and 2)
- AlexiosC

## Sheet 6 of 7
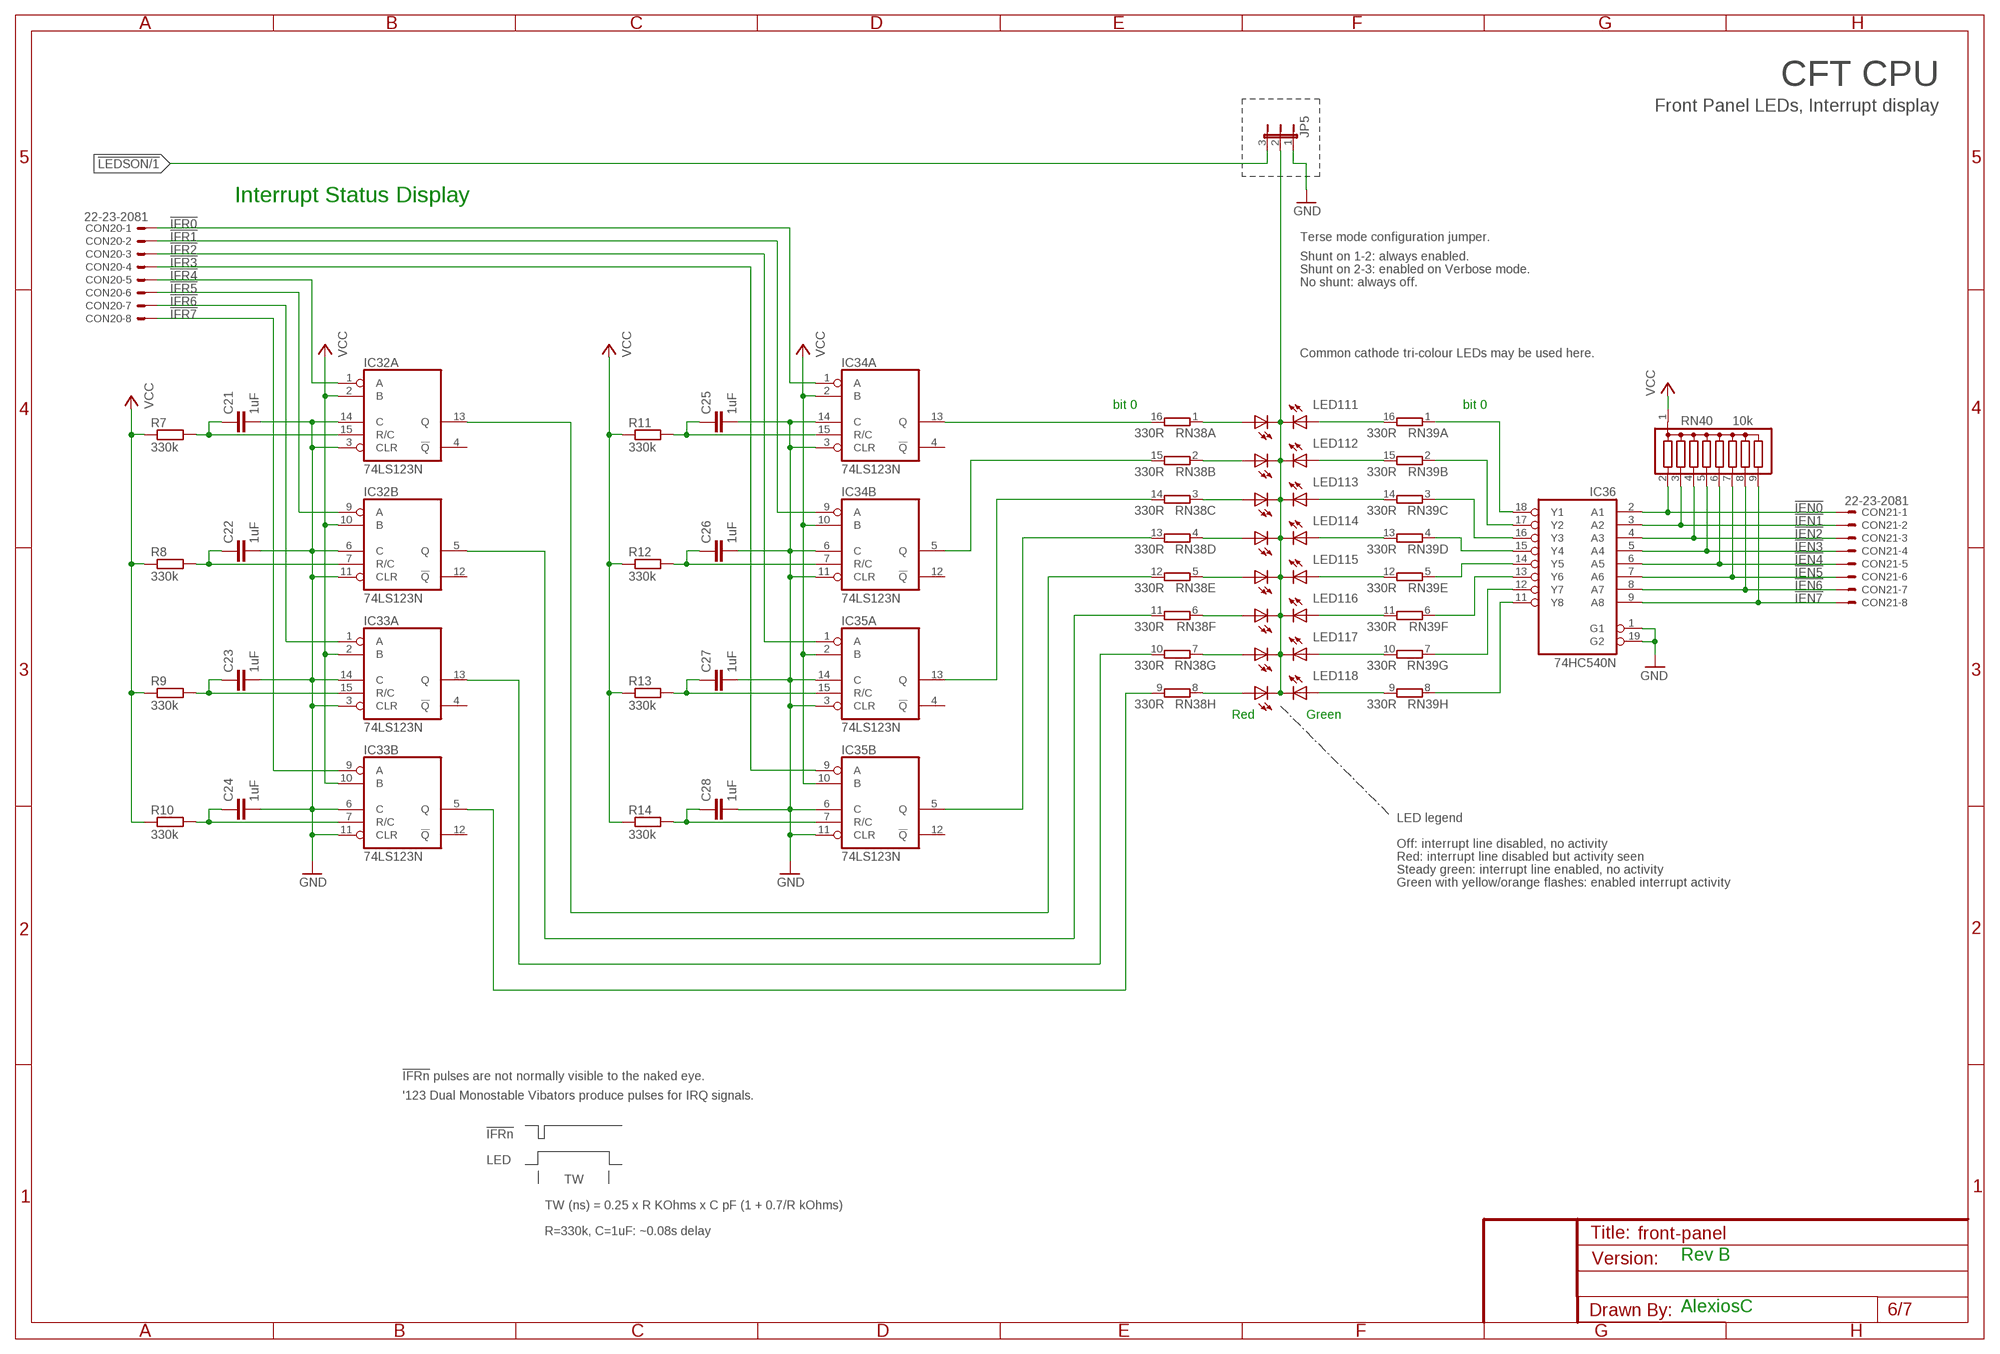
[diagram p5: schematic, sheet 6]

### Parts
C21  1uF  C-EU025-024X044  [C025-024X044]
C22  1uF  C-EU025-024X044  [C025-024X044]
C23  1uF  C-EU025-024X044  [C025-024X044]
C24  1uF  C-EU025-024X044  [C025-024X044]
C25  1uF  C-EU025-024X044  [C025-024X044]
C26  1uF  C-EU025-024X044  [C025-024X044]
C27  1uF  C-EU025-024X044  [C025-024X044]
C28  1uF  C-EU025-024X044  [C025-024X044]
CON20  22-23-2081  [22-23-2081]
CON21  22-23-2081  [22-23-2081]
IC32  74LS123N  [DIL16]
IC33  74LS123N  [DIL16]
IC34  74LS123N  [DIL16]
IC35  74LS123N  [DIL16]
IC36  74HC540N  [DIL20]
JP5  JP2E  [JP2]
LED111  DUOLED-C  [DUOLED-C-5MM]
LED112  DUOLED-C  [DUOLED-C-5MM]
LED113  DUOLED-C  [DUOLED-C-5MM]
LED114  DUOLED-C  [DUOLED-C-5MM]
LED115  DUOLED-C  [DUOLED-C-5MM]
LED116  DUOLED-C  [DUOLED-C-5MM]
LED117  DUOLED-C  [DUOLED-C-5MM]
LED118  DUOLED-C  [DUOLED-C-5MM]
R7  330k  R-EU_0204/5  [0204/5]
R8  330k  R-EU_0204/5  [0204/5]
R9  330k  R-EU_0204/5  [0204/5]
R10  330k  R-EU_0204/5  [0204/5]
R11  330k  R-EU_0204/5  [0204/5]
R12  330k  R-EU_0204/5  [0204/5]
R13  330k  R-EU_0204/5  [0204/5]
R14  330k  R-EU_0204/5  [0204/5]
RN38  330R  8R-N  [DIL16]
RN39  330R  8R-N  [DIL16]
RN40  10k  G08R  [SIL9]

### Nets
!IEN0: CON21.1 IC36.2(A1) RN40.2
!IEN1: CON21.2 IC36.3(A2) RN40.3
!IEN2: CON21.3 IC36.4(A3) RN40.4
!IEN3: CON21.4 IC36.5(A4) RN40.5
!IEN4: CON21.5 IC36.6(A5) RN40.6
!IEN5: CON21.6 IC36.7(A6) RN40.7
!IEN6: CON21.7 IC36.8(A7) RN40.8
!IEN7: CON21.8 IC36.9(A8) RN40.9
!IFR0: CON20.1 IC34.1(A:A)
!IFR1: CON20.2 IC34.9(B:A) ; also sheet 2,7
!IFR2: CON20.3 IC35.1(A:A)
!IFR3: CON20.4 IC35.9(B:A)
!IFR4: CON20.5 IC32.1(A:A)
!IFR5: CON20.6 IC32.9(B:A)
!IFR6: CON20.7 IC33.1(A:A) ; also sheet 2,7
!IFR7: CON20.8 IC33.9(B:A)
!LEDSON: JP5.3 ; also sheet 1,3,4
GND: C21.2 C22.2 C23.2 C24.2 C25.2 C26.2 C27.2 C28.2 IC32.3(A:CLR) IC32.6(B:C) IC32.11(B:CLR) IC32.14(A:C) IC33.3(A:CLR) IC33.6(B:C) IC33.11(B:CLR) IC33.14(A:C) IC34.3(A:CLR) IC34.6(B:C) IC34.11(B:CLR) IC34.14(A:C) IC35.3(A:CLR) IC35.6(B:C) IC35.11(B:CLR) IC35.14(A:C) IC36.1(G1) IC36.19(G2) JP5.1 ; also sheet 1,2,3,4,5,7
N$102: JP5.2 LED111.C LED112.C LED113.C LED114.C LED115.C LED116.C LED117.C LED118.C
N$248: LED118.AX(AG) RN39.9
N$249: LED117.AX(AG) RN39.10
N$250: LED116.AX(AG) RN39.11
N$251: LED115.AX(AG) RN39.12
N$252: LED114.AX(AG) RN39.13
N$253: LED113.AX(AG) RN39.14
N$254: LED112.AX(AG) RN39.15
N$255: LED111.AX(AG) RN39.16
N$256: LED118.AR RN38.8
N$257: LED117.AR RN38.7
N$258: LED116.AR RN38.6
N$259: LED115.AR RN38.5
N$260: LED114.AR RN38.4
N$261: LED113.AR RN38.3
N$262: LED112.AR RN38.2
N$263: LED111.AR RN38.1
N$285: IC32.13(A:Q) RN38.12
N$287: IC33.5(B:Q) RN38.9
N$288: IC33.13(A:Q) RN38.10
N$289: IC32.5(B:Q) RN38.11
N$303: C21.1 IC32.15(A:R/C) R7.2
N$304: C22.1 IC32.7(B:R/C) R8.2
N$305: C23.1 IC33.15(A:R/C) R9.2
N$306: C24.1 IC33.7(B:R/C) R10.2
N$307: C28.1 IC35.7(B:R/C) R14.2
N$308: C27.1 IC35.15(A:R/C) R13.2
N$309: C26.1 IC34.7(B:R/C) R12.2
N$310: C25.1 IC34.15(A:R/C) R11.2
N$347: IC36.15(Y4) RN39.4
N$348: IC36.14(Y5) RN39.5
N$349: IC36.16(Y3) RN39.3
N$350: IC36.17(Y2) RN39.2
N$351: IC36.18(Y1) RN39.1
N$352: IC36.13(Y6) RN39.6
N$353: IC36.12(Y7) RN39.7
N$354: IC36.11(Y8) RN39.8
N$355: IC35.5(B:Q) RN38.13
N$357: IC35.13(A:Q) RN38.14
N$358: IC34.5(B:Q) RN38.15
N$359: IC34.13(A:Q) RN38.16
VCC: IC32.2(A:B) IC32.10(B:B) IC33.2(A:B) IC33.10(B:B) IC34.2(A:B) IC34.10(B:B) IC35.2(A:B) IC35.10(B:B) R7.1 R8.1 R9.1 R10.1 R11.1 R12.1 R13.1 R14.1 RN40.1 ; also sheet 1,2,3,4,5,7
Unconnected: IC32.4(A:!Q) IC32.12(B:!Q) IC33.4(A:!Q) IC33.12(B:!Q) IC34.4(A:!Q) IC34.12(B:!Q) IC35.4(A:!Q) IC35.12(B:!Q)

### Notes on the sheet
- CFT CPU
- Front Panel LEDs, Interrupt display
- Interrupt Status Display
- Terse mode configuration jumper.
- Shunt on 1-2: always enabled.
- Shunt on 2-3: enabled on Verbose mode.
- No shunt: always off.
- Common cathode tri-colour LEDs may be used here.
- bit 0 | bit 0
- Red | Green
- LED legend
- Off: interrupt line disabled, no activity
- Red: interrupt line disabled but activity seen
- Steady green: interrupt line enabled, no activity
- Green with yellow/orange flashes: enabled interrupt activity
- !IFRn! pulses are not normally visible to the naked eye.
- '123 Dual Monostable Vibators produce pulses for IRQ signals.
- !IFRn!
- LED
- TW
- TW (ns) = 0.25 x R KOhms x C pF (1 + 0.7/R kOhms)
- R=330k, C=1uF: ~0.08s delay
- Rev B
- AlexiosC

## Sheet 7 of 7
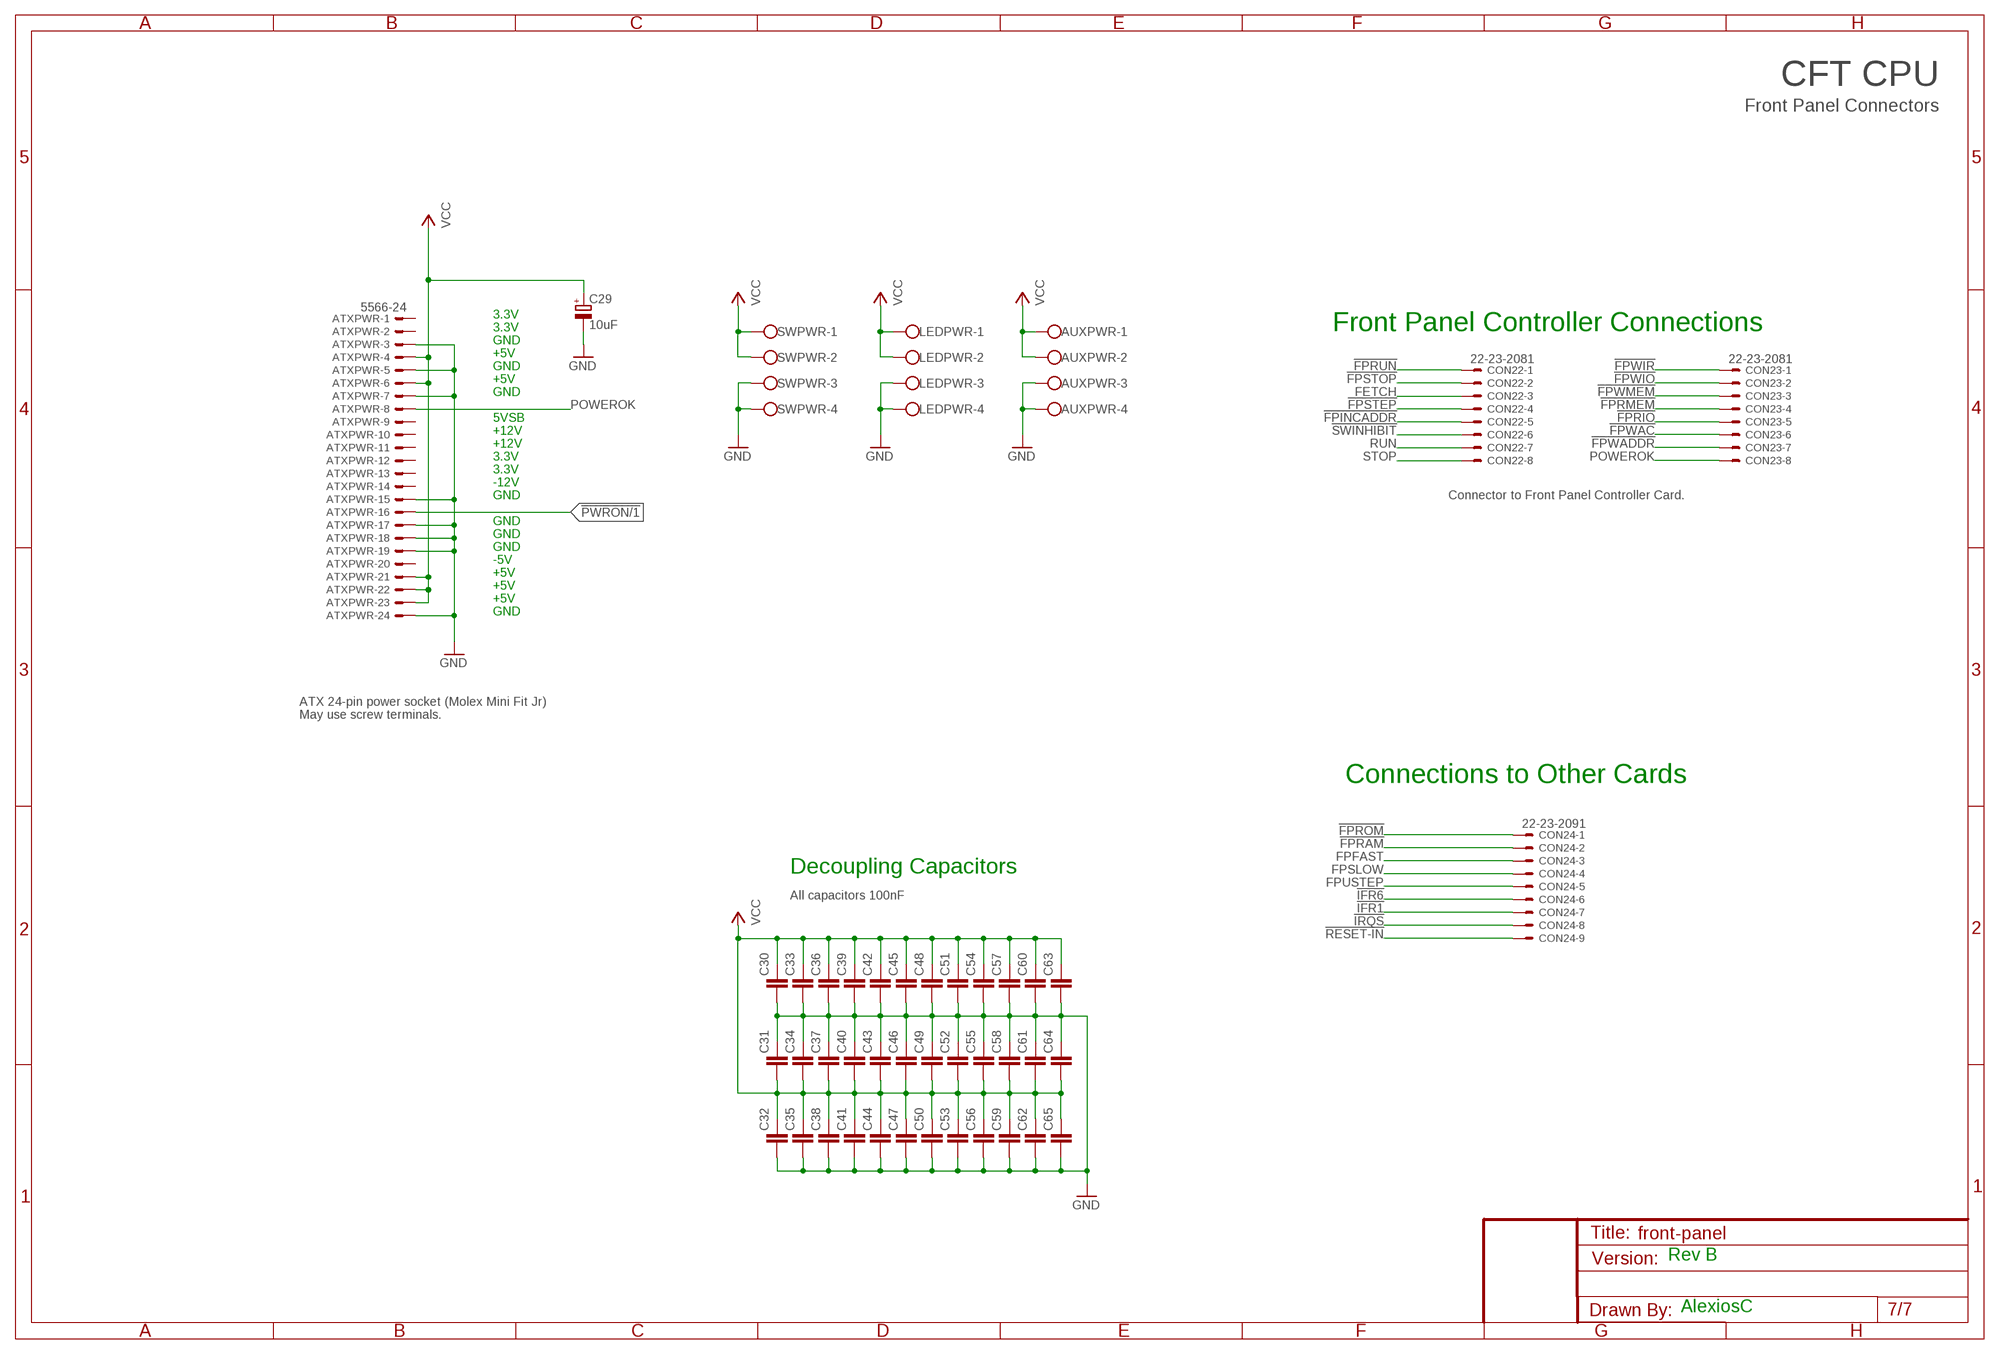
[diagram p6: schematic, sheet 7]

### Parts
ATXPWR  5566-24  [5566-24]
AUXPWR  W237-4  [W237-4]
C29  10uF  CPOL-EUE2.5-7  [E2,5-7]
C30  100nF  C-EU025-024X044  [C025-024X044]
C31  100nF  C-EU025-024X044  [C025-024X044]
C32  100nF  C-EU025-024X044  [C025-024X044]
C33  100nF  C-EU025-024X044  [C025-024X044]
C34  100nF  C-EU025-024X044  [C025-024X044]
C35  100nF  C-EU025-024X044  [C025-024X044]
C36  100nF  C-EU025-024X044  [C025-024X044]
C37  100nF  C-EU025-024X044  [C025-024X044]
C38  100nF  C-EU025-024X044  [C025-024X044]
C39  100nF  C-EU025-024X044  [C025-024X044]
C40  100nF  C-EU025-024X044  [C025-024X044]
C41  100nF  C-EU025-024X044  [C025-024X044]
C42  100nF  C-EU025-024X044  [C025-024X044]
C43  100nF  C-EU025-024X044  [C025-024X044]
C44  100nF  C-EU025-024X044  [C025-024X044]
C45  100nF  C-EU025-024X044  [C025-024X044]
C46  100nF  C-EU025-024X044  [C025-024X044]
C47  100nF  C-EU025-024X044  [C025-024X044]
C48  100nF  C-EU025-024X044  [C025-024X044]
C49  100nF  C-EU025-024X044  [C025-024X044]
C50  100nF  C-EU025-024X044  [C025-024X044]
C51  100nF  C-EU025-024X044  [C025-024X044]
C52  100nF  C-EU025-024X044  [C025-024X044]
C53  100nF  C-EU025-024X044  [C025-024X044]
C54  100nF  C-EU025-024X044  [C025-024X044]
C55  100nF  C-EU025-024X044  [C025-024X044]
C56  100nF  C-EU025-024X044  [C025-024X044]
C57  100nF  C-EU025-024X044  [C025-024X044]
C58  100nF  C-EU025-024X044  [C025-024X044]
C59  100nF  C-EU025-024X044  [C025-024X044]
C60  100nF  C-EU025-024X044  [C025-024X044]
C61  100nF  C-EU025-024X044  [C025-024X044]
C62  100nF  C-EU025-024X044  [C025-024X044]
C63  100nF  C-EU025-024X044  [C025-024X044]
C64  100nF  C-EU025-024X044  [C025-024X044]
C65  100nF  C-EU025-024X044  [C025-024X044]
CON22  22-23-2081  [22-23-2081]
CON23  22-23-2081  [22-23-2081]
CON24  22-23-2091  [22-23-2091]
LEDPWR  W237-4  [W237-4]
SWPWR  W237-4  [W237-4]

### Nets
!FPINCADDR: CON22.5 ; also sheet 2
!FPRAM: CON24.2 ; also sheet 1
!FPRIO: CON23.5 ; also sheet 2
!FPRMEM: CON23.4 ; also sheet 2
!FPROM: CON24.1 ; also sheet 1
!FPRUN: CON22.1 ; also sheet 2
!FPSTEP: CON22.4 ; also sheet 1
!FPSTOP: CON22.2 ; also sheet 2
!FPWAC: CON23.6 ; also sheet 2
!FPWADDR: CON23.7 ; also sheet 2
!FPWIO: CON23.2 ; also sheet 2
!FPWIR: CON23.1 ; also sheet 2
!FPWMEM: CON23.3 ; also sheet 2
!IFR1: CON24.7 ; also sheet 2,6
!IFR6: CON24.6 ; also sheet 2,6
!IRQS: CON24.8 ; also sheet 4,5
!PWRON: ATXPWR.16 ; also sheet 1
!RESET-IN: CON24.9 ; also sheet 2
!SWINHIBIT: CON22.6 ; also sheet 2
FETCH: CON22.3 ; also sheet 4,5
FPFAST: CON24.3 ; also sheet 1
FPSLOW: CON24.4 ; also sheet 1
FPUSTEP: CON24.5 ; also sheet 1
GND: ATXPWR.3 ATXPWR.5 ATXPWR.7 ATXPWR.15 ATXPWR.17 ATXPWR.18 ATXPWR.19 ATXPWR.24 AUXPWR.3 AUXPWR.4 C29.- C30.2 C31.1 C32.2 C33.2 C34.1 C35.2 C36.2 C37.1 C38.2 C39.2 C40.1 C41.2 C42.2 C43.1 C44.2 C45.2 C46.1 C47.2 C48.2 C49.1 C50.2 C51.2 C52.1 C53.2 C54.2 C55.1 C56.2 C57.2 C58.1 C59.2 C60.2 C61.1 C62.2 C63.2 C64.1 C65.2 LEDPWR.3 LEDPWR.4 SWPWR.3 SWPWR.4 ; also sheet 1,2,3,4,5,6
POWEROK: ATXPWR.8 CON23.8
RUN: CON22.7 ; also sheet 4
STOP: CON22.8 ; also sheet 4
VCC: ATXPWR.4 ATXPWR.6 ATXPWR.21 ATXPWR.22 ATXPWR.23 AUXPWR.1 AUXPWR.2 C29.+ C30.1 C31.2 C32.1 C33.1 C34.2 C35.1 C36.1 C37.2 C38.1 C39.1 C40.2 C41.1 C42.1 C43.2 C44.1 C45.1 C46.2 C47.1 C48.1 C49.2 C50.1 C51.1 C52.2 C53.1 C54.1 C55.2 C56.1 C57.1 C58.2 C59.1 C60.1 C61.2 C62.1 C63.1 C64.2 C65.1 LEDPWR.1 LEDPWR.2 SWPWR.1 SWPWR.2 ; also sheet 1,2,3,4,5,6
Unconnected: ATXPWR.1 ATXPWR.2 ATXPWR.9 ATXPWR.10 ATXPWR.11 ATXPWR.12 ATXPWR.13 ATXPWR.14 ATXPWR.20

### Notes on the sheet
- CFT CPU
- Front Panel Connectors
- 3.3V
- 3.3V | Front Panel Controller Connections
- GND
- +5V
- GND
- +5V
- GND
- 5VSB
- +12V
- +12V
- 3.3V
- 3.3V
- -12V
- GND | Connector to Front Panel Controller Card.
- GND
- GND
- GND
- -5V
- +5V
- +5V
- +5V
- GND
- ATX 24-pin power socket (Molex Mini Fit Jr)
- May use screw terminals.
- Connections to Other Cards
- Decoupling Capacitors
- All capacitors 100nF
- Rev B
- AlexiosC

## Power pins joined to a net without a drawn wire
GND: IC1.7(P:GND) IC2.8(P:GND) IC4.7(P:GND) IC5.7(P:GND) IC6.7(P:GND) IC7.7(P:GND) IC8.7(P:GND) IC9.7(P:GND) IC10.7(P:GND) IC11.10(GND) IC12.10(GND) IC13.10(GND) IC14.10(GND) IC15.10(GND) IC16.10(GND) IC17.10(GND) IC18.10(GND) IC19.10(GND) IC20.10(GND) IC21.10(GND) IC22.8(P:GND) IC23.10(GND) IC24.8(GND) IC25.10(GND) IC26.10(GND) IC27.10(GND) IC28.10(GND) IC29.10(GND) IC30.10(GND) IC31.8(GND) IC32.8(P:GND) IC33.8(P:GND) IC34.8(P:GND) IC35.8(P:GND) IC36.10(GND)
VCC: IC1.14(P:VCC) IC2.16(P:VCC) IC4.14(P:VCC) IC5.14(P:VCC) IC6.14(P:VCC) IC7.14(P:VCC) IC8.14(P:VCC) IC9.14(P:VCC) IC10.14(P:VCC) IC11.20(VCC) IC12.20(VCC) IC13.20(VCC) IC14.20(VCC) IC15.20(VCC) IC16.20(VCC) IC17.20(VCC) IC18.20(VCC) IC19.20(VCC) IC20.20(VCC) IC21.20(VCC) IC22.16(P:VCC) IC23.20(VCC) IC24.16(VCC) IC25.20(VCC) IC26.20(VCC) IC27.20(VCC) IC28.20(VCC) IC29.20(VCC) IC30.20(VCC) IC31.16(VCC) IC32.16(P:VCC) IC33.16(P:VCC) IC34.16(P:VCC) IC35.16(P:VCC) IC36.20(VCC)

## Library data of the parts
ATXPWR = con-molex:5566-24: Mini FIT connector 24 pol Source: http://www.molex.com; OC_FARNELL: unknown; OC_NEWARK: unknown
AUXPWR LEDPWR SWPWR = con-wago-500:W237-4: WAGO SCREW CLAMP; OC_FARNELL: unknown; OC_NEWARK: unknown
C1-C5 C7-C19 C29 = rcl:CPOL-EU: POLARIZED CAPACITOR, European symbol
C6 C20-C28 C30-C65 = rcl:C-EU: CAPACITOR, European symbol
CON1-CON4 CON6-CON12 CON14-CON23 = con-molex:22-23-2081: .100" (2.54mm) Center Header - 8 Pin; MF: MOLEX; MPN: 22-23-2081; OC_FARNELL: 1756826; OC_NEWARK: 01C7592
CON5 CON24 = con-molex:22-23-2091: .100" (2.54mm) Center Header - 9 Pin; MF: MOLEX; MPN: 22-23-2091; OC_FARNELL: 1756827; OC_NEWARK: 56H0450
CON13 = con-molex:22-23-2051: .100" (2.54mm) Center Header - 5 Pin; MF: MOLEX; MPN: 22-23-2051; OC_FARNELL: 1462952; OC_NEWARK: 38C9178
D1-D3 = diode:1N4148: DIODE high speed (Philips)
IC1 IC6 IC8 = 74xx-eu:74*14: Hex schmitt trigger INVERTER
IC2 IC22 IC32-IC35 = 74xx-eu:74*123: Retriggerable monostable MULTIVIBRATOR
IC3 = linear:*555: TIMER
IC4 IC7 IC9 = 74xx-eu:74*04: Hex INVERTER
IC5 = 74xx-eu:74*00: Quad 2-input NAND gate
IC10 = 74xx-eu:74*03: Quad 2-input NAND gate, open collector output
IC11-IC19 IC23 IC25-IC30 = 74xx-eu:74*541: Octal BUFFER and LINE DRIVER, 3-state
IC20 IC21 IC36 = 74xx-eu:74*540: Octal BUFFER and LINE DRIVER, 3-state
IC24 = 74xx-eu:74*138: 3-line to 8-line DECODER/DEMULTIPLEXER
IC31 = 74xx-eu:74*85: 4-bit magnitude COMPARATOR
JP1-JP5 = jumper:JP2E: JUMPER
LED1-LED110 = alexios:LED-5MM: 5mm LED Standard 5mm LED with filled in diode outline and colour options for the sake of generating bills of materials.
LED111-LED118 = alexios:DUOLED-C: Common cathode duo LED (tri-color).
R1 R4 = pot:TRIM_EU-: POTENTIOMETER
R2 R3 R6 = resistor:R-EU_: RESISTOR, European symbol
R5 R7-R14 = rcl:R-EU_: RESISTOR, European symbol
RN1 RN3 RN38 RN39 = resistor-dil:8R-N: DIL RESISTOR; OC_FARNELL: unknown; OC_NEWARK: unknown
RN2 RN4 RN6-RN8 RN12 RN13 RN16 RN17 RN20-RN22 RN29-RN32 RN34 RN35 RN40 = resistor-sil:G08R: SIL RESISTOR; OC_FARNELL: unknown; OC_NEWARK: unknown
RN5 = resistor-sil:G06R: SIL RESISTOR; OC_FARNELL: unknown; OC_NEWARK: unknown
RN9 RN10 RN14 RN15 RN18 RN19 RN23-RN25 RN27 RN28 RN36 RN37 = resistor-sil:GE08R: SIL RESISTOR; OC_FARNELL: unknown; OC_NEWARK: unknown
RN11 = resistor-sil:GE09R: SIL RESISTOR; OC_FARNELL: unknown; OC_NEWARK: unknown
RN26 = resistor-sil:G05R: SIL RESISTOR; OC_FARNELL: unknown; OC_NEWARK: unknown
RN33 = resistor-sil:G03R: SIL RESISTOR; OC_FARNELL: unknown; OC_NEWARK: unknown
S1-S16 S18 S19 = switch:TL36PO: TINY SWITCH ON - ON Source: http://www2.produktinfo.conrad.com/datenblaetter/700000-724999/705152-da-01-de-Subminiaturschalter_TL_36YO.pdf
S17 = switch:320-938: TOGGLE SWITCH distributor RS Components
S20 S29 = switch:TL49PO: TINY SWITCH ON OFF ON Source: http://www2.produktinfo.conrad.com/datenblaetter/700000-724999/705152-da-01-de-Subminiaturschalter_TL_36YO.pdf
S21 S23 S24 S30 S31 = switch:TL37PO: TINY SWITCH MOM OFF MOM Source: http://www2.produktinfo.conrad.com/datenblaetter/700000-724999/705152-da-01-de-Subminiaturschalter_TL_36YO.pdf
S22 S25-S28 = switch:TL47PO: TINY SWITCH MOM OFF MOM Source: http://www2.produktinfo.conrad.com/datenblaetter/700000-724999/705152-da-01-de-Subminiaturschalter_TL_36YO.pdf
SV1 = con-lstb:MA03-2: PIN HEADER; OC_FARNELL: unknown; OC_NEWARK: unknown
SW1 = special:SW_DIP-3: DIP SWITCH

## Net classes
0 default: width 0.305 mm, clearance 0.254 mm
1 Power: width 0.914 mm, clearance 0.254 mm